# EAGLE board miniSpartan6+_Rev_B (EAGLE 7.1.0), part 1 of 2
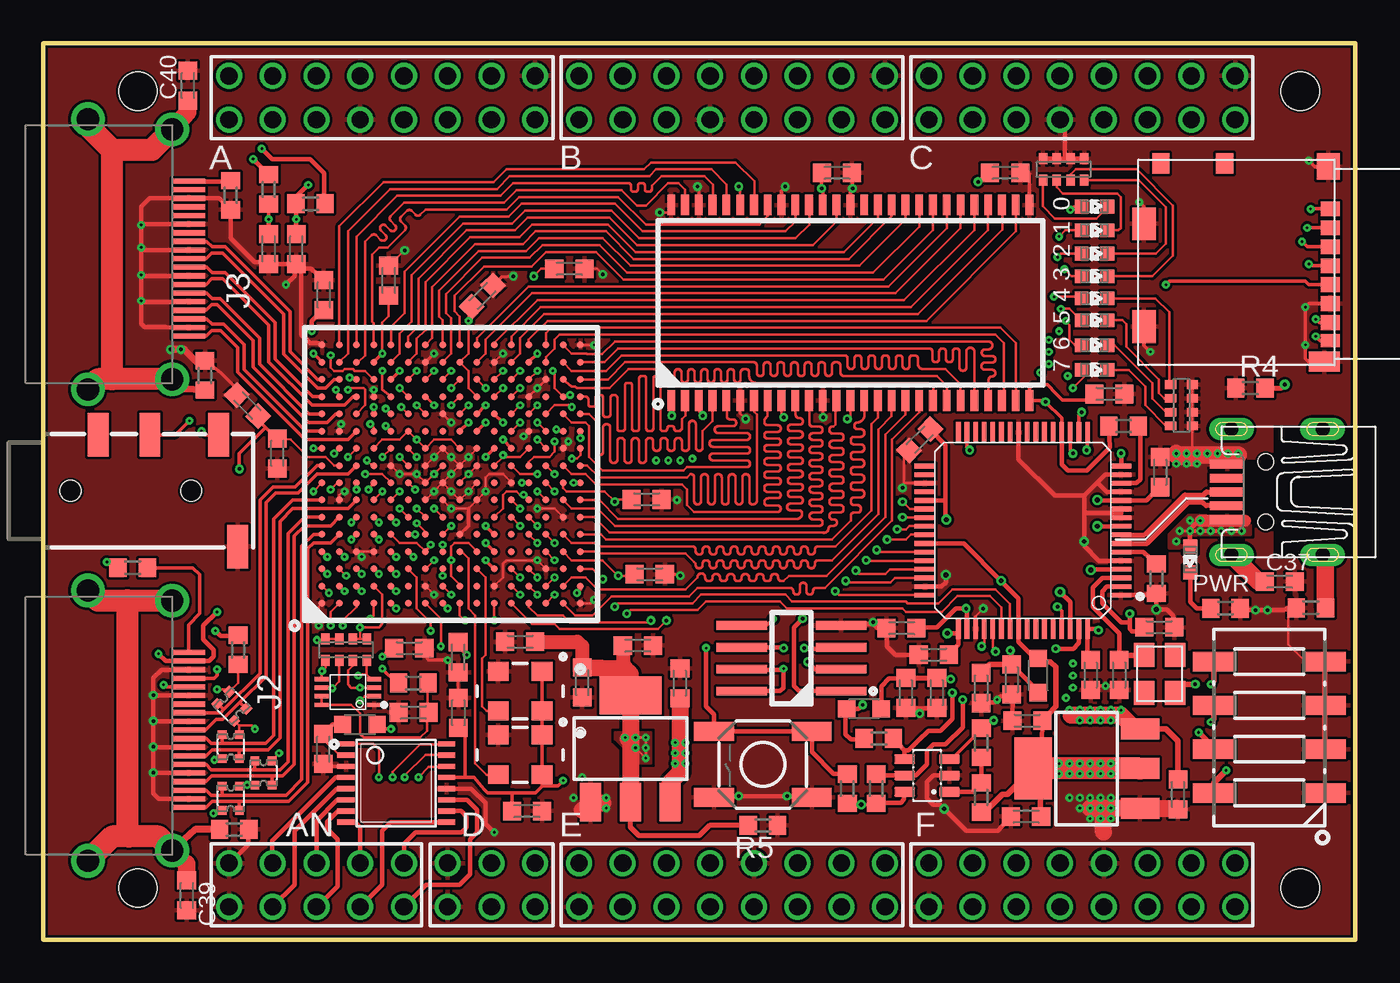
[diagram p4: board, top side]
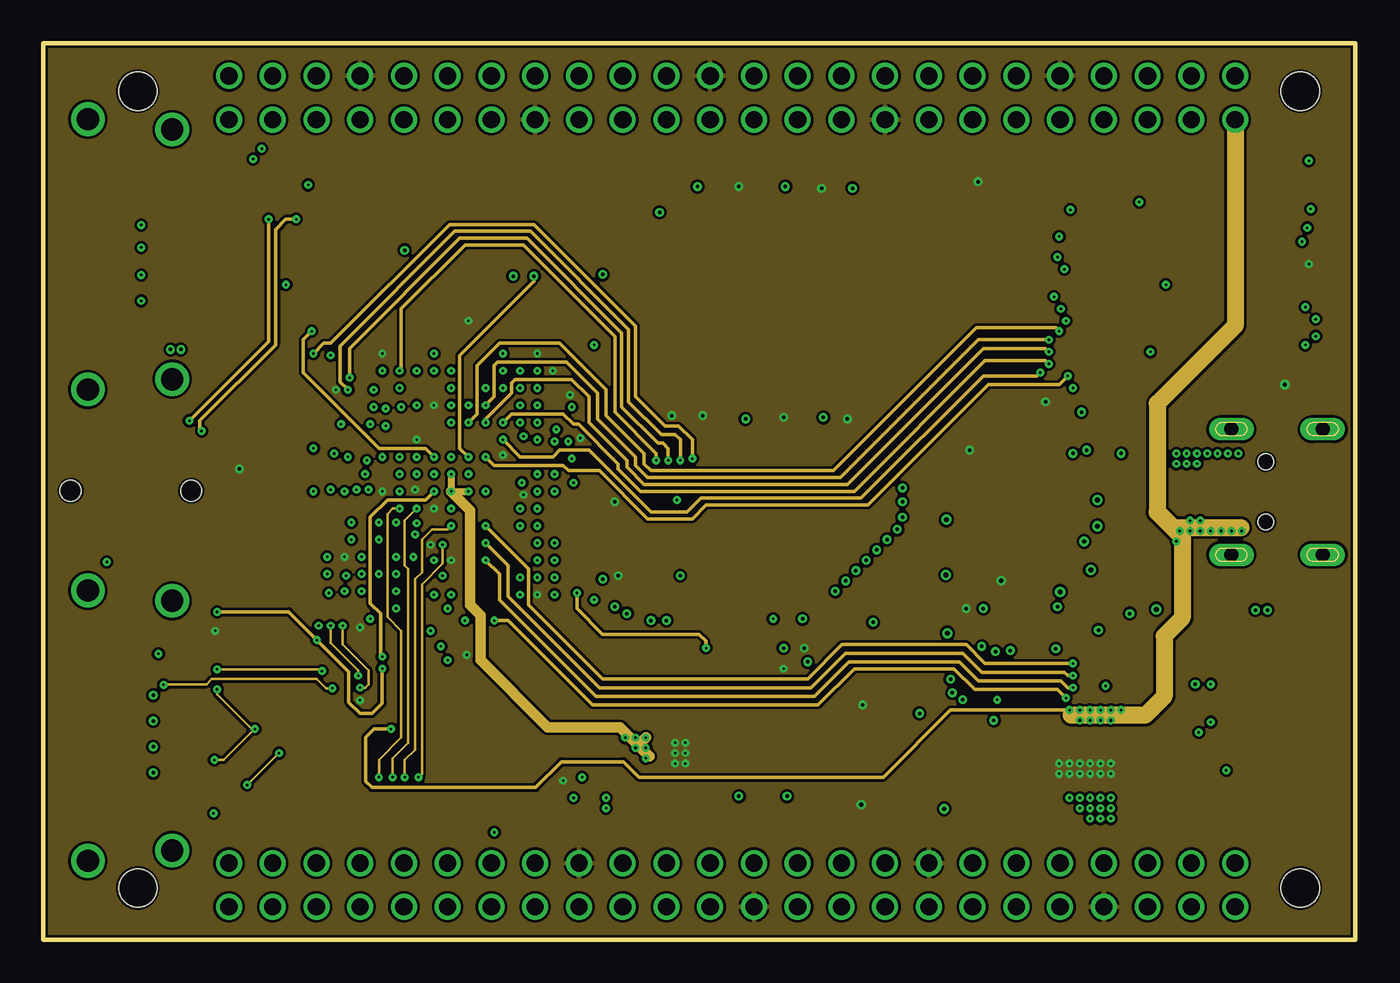
[diagram p5: board, inner layer Route3]
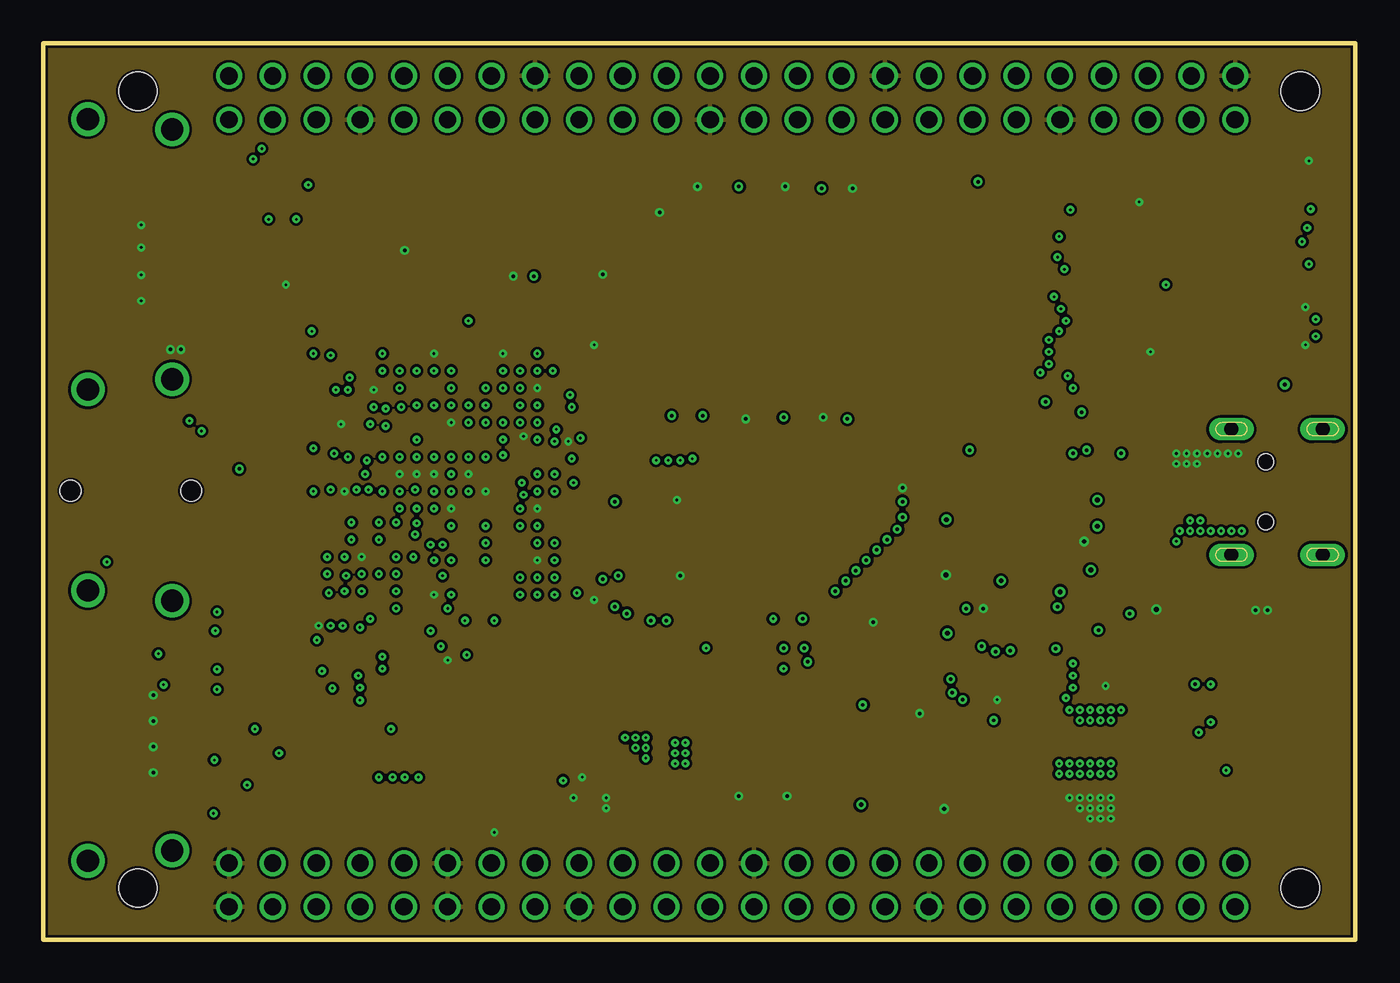
[diagram p6: board, inner layer Route4]
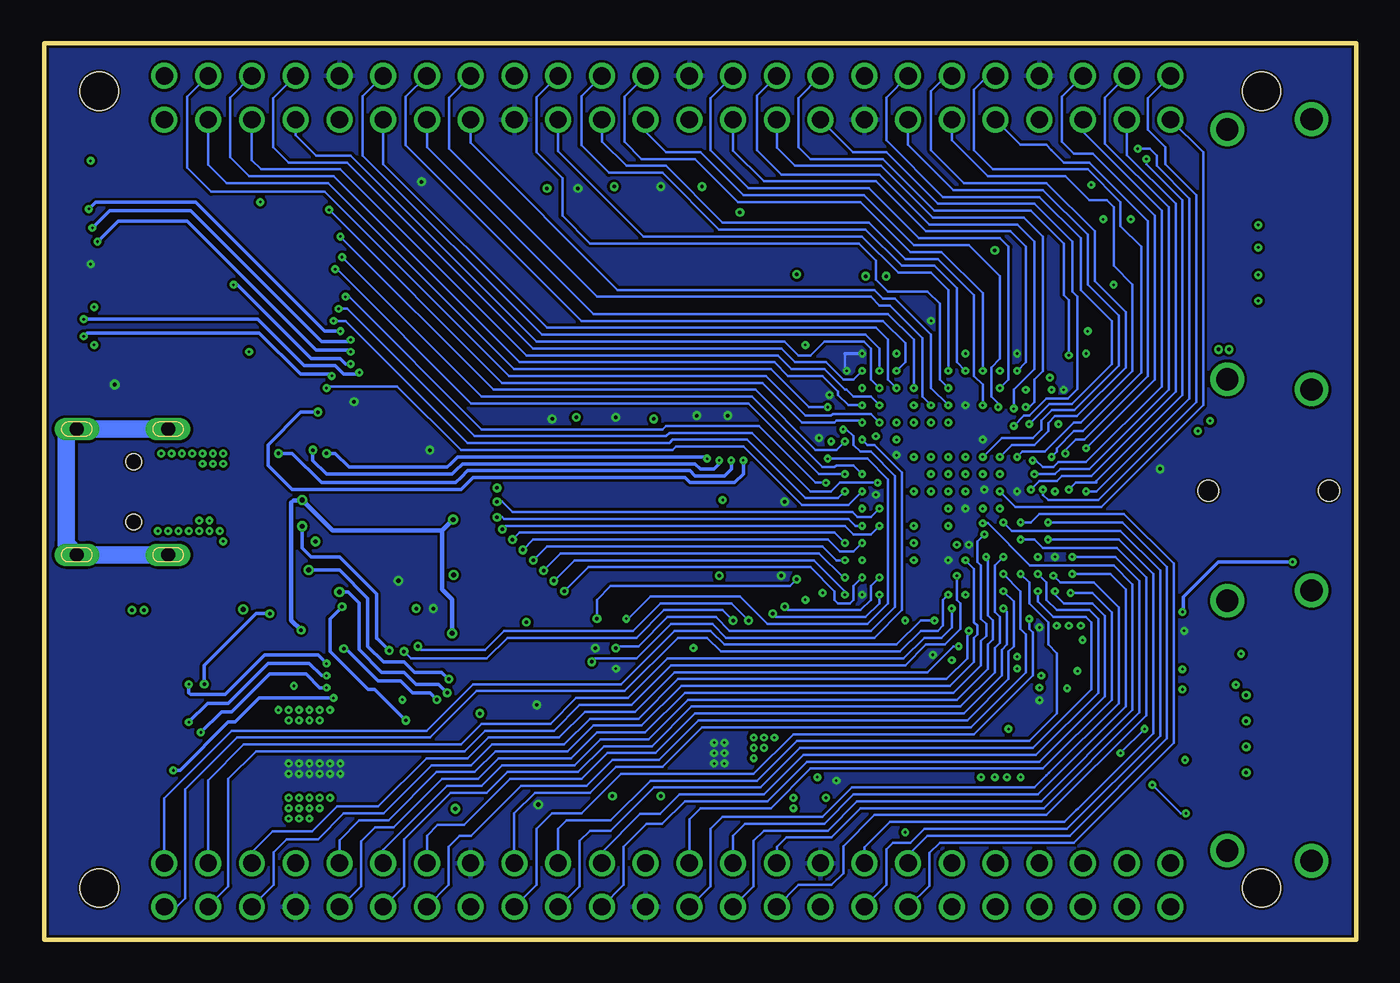
[diagram p7: board, bottom side, seen from below]

Size 76.2 x 52.07 mm. Coordinates in mm from the lower left corner, seen from the top.
Outline: 0,0 76.2,0 76.2,52.07 0,52.07 0,0
Copper layers (1*3+4*16): Top 0.035mm / dielectric 0.2mm / Route3 0.035mm / dielectric 1mm / Route4 0.035mm / dielectric 0.25mm / Bottom 0.035mm
Design rules "default *": minimum track width 6mil, minimum drill 6mil, track to track 6mil, track to pad 6mil, pad to pad 6mil, via to via 6mil, smd to smd 0mil, copper to edge 6mil, drill to drill 6mil, minimum pad ring 10mil, minimum via ring 6mil, stop-mask expansion 2mil, vias tented up to drill 100mil, thermal gap 6mil
Net classes: 1 power: width 0.203 mm
Holes 2.2 mm at 5.5,49.27 73,49.27 73,3 5.5,3
tRestrict: 1 lines

## Footprints (pad centres in the part's own frame; a part is rotated, then mirrored left to right if it is on the bottom)
C0603K = smd 1.05 x 1.08: 1 -0.875,0; 2 0.875,0
FCI-HDMI-TYPE-A-RECEPT = smd 1.9 x 0.3: 1 -0.95,4.5; 2 -0.95,4; 3 -0.95,3.5; 4 -0.95,3; 5 -0.95,2.5; 6 -0.95,2; 7 -0.95,1.5; 8 -0.95,1; 9 -0.95,0.5; 10 -0.95,0; 11 -0.95,-0.5; 12 -0.95,-1; 13 -0.95,-1.5; 14 -0.95,-2; 15 -0.95,-2.5; 16 -0.95,-3; 17 -0.95,-3.5; 18 -0.95,-4; 19 -0.95,-4.5 | drill 1.3: SH1 4.9,7.6; SH2 0,7; SH3 0,-7.5; SH4 4.9,-8.1
1X24 = drill 1: P$1 29.21,0; P$2 26.67,0; P$3 24.13,0; P$4 21.59,0; P$5 19.05,0; P$6 16.51,0; P$7 13.97,0; P$8 11.43,0; P$9 8.89,0; P$10 6.35,0; P$11 3.81,0; P$12 1.27,0; P$13 -1.27,0; P$14 -3.81,0; P$15 -6.35,0; P$16 -8.89,0; P$17 -11.43,0; P$18 -13.97,0; P$19 -16.51,0; P$20 -19.05,0; P$21 -21.59,0; P$22 -24.13,0; P$23 -26.67,0; P$24 -29.21,0
MICROSD_104031 = smd 1.55 x 1.35: G1 5.565,0.375 | smd 1.17 x 1.8: G2 -5.755,0.6 | smd 1.9 x 1.35: G3 -3.73,11.075; G4 2.24,11.075 | smd 1.2 x 1: S1 5.74,10.1; S2 5.74,6.4 | smd 0.85 x 1.1: T1 3.105,0.25; T2 2.005,0.25; T3 0.905,0.25; T4 -0.195,0.25; T5 -1.295,0.25; T6 -2.395,0.25; T7 -3.495,0.25 | smd 0.75 x 1.1: T8 -4.545,0.25
AUDIO-JACK-TRRS-SMD = smd 1.2 x 2.5: EARTH 11.3,-3.25; RING1 6.2,3.25; RING2 3.2,3.25; TIP 10.2,3.25 | hole 1.2: 1.6,0; 8.6,0
L2012C = smd 1 x 1: 1 -1,0; 2 1,0
SML0603 = smd 0.8 x 0.8: A 0.75,0; C -0.75,0
CRYSTAL3.2X2.5MM = smd 1.4 x 1.2: 1 -1.1,-0.9; 2 1.1,-0.9; 3 1.1,0.9; 4 -1.1,0.9
R0603 = smd 1 x 1.1: 1 -0.85,0; 2 0.85,0
0603-ARV = smd 0.5 x 0.65: 1 -1.2,-0.625; 2 -0.4,-0.625; 3 0.4,-0.625; 4 1.2,-0.625; 5 1.2,0.625; 6 0.4,0.625; 7 -0.4,0.625; 8 -1.2,0.625
EXB34V = smd 0.5 x 0.5: 1 -0.5,-0.7; 2 0.5,-0.7; 3 0.5,0.7; 4 -0.5,0.7
TACTILE_SWITCH_SMD = smd 2.3 x 1.1: 1 -2.84,1.905; 2 2.84,1.905; 3 -2.84,-1.905; 4 2.84,-1.905
CTS-219-04J = smd 1.13 x 2.44: 1 -3.81,-3.215; 2 -1.27,-3.215; 3 1.27,-3.215; 4 3.81,-3.215; 5 3.81,3.215; 6 1.27,3.215; 7 -1.27,3.215; 8 -3.81,3.215
SOT23-6 = smd 0.55 x 1.2: 1 -0.95,-1.3; 2 0,-1.3; 3 0.95,-1.3; 4 0.95,1.3; 5 0,1.3; 6 -0.95,1.3
LQFP64 = smd 1.2 x 0.27: 1 -5.7,3.75; 2 -5.7,3.25; 3 -5.7,2.75; 4 -5.7,2.25; 5 -5.7,1.75; 6 -5.7,1.25; 7 -5.7,0.75; 8 -5.7,0.25; 9 -5.7,-0.25; 10 -5.7,-0.75; 11 -5.7,-1.25; 12 -5.7,-1.75; 13 -5.7,-2.25; 14 -5.7,-2.75; 15 -5.7,-3.25; 16 -5.7,-3.75; 33 5.7,-3.75; 34 5.7,-3.25; 35 5.7,-2.75; 36 5.7,-2.25; 37 5.7,-1.75; 38 5.7,-1.25; 39 5.7,-0.75; 40 5.7,-0.25; 41 5.7,0.25; 42 5.7,0.75; 43 5.7,1.25; 44 5.7,1.75; 45 5.7,2.25; 46 5.7,2.75; 47 5.7,3.25; 48 5.7,3.75 | smd 0.27 x 1.2: 17 -3.75,-5.7; 18 -3.25,-5.7; 19 -2.75,-5.7; 20 -2.25,-5.7; 21 -1.75,-5.7; 22 -1.25,-5.7; 23 -0.75,-5.7; 24 -0.25,-5.7; 25 0.25,-5.7; 26 0.75,-5.7; 27 1.25,-5.7; 28 1.75,-5.7; 29 2.25,-5.7; 30 2.75,-5.7; 31 3.25,-5.7; 32 3.75,-5.7; 49 3.75,5.7; 50 3.25,5.7; 51 2.75,5.7; 52 2.25,5.7; 53 1.75,5.7; 54 1.25,5.7; 55 0.75,5.7; 56 0.25,5.7; 57 -0.25,5.7; 58 -0.75,5.7; 59 -1.25,5.7; 60 -1.75,5.7; 61 -2.25,5.7; 62 -2.75,5.7; 63 -3.25,5.7; 64 -3.75,5.7
TSSOP16 = smd 0.305 x 0.991: 1 -2.275,-2.918; 2 -1.625,-2.918; 3 -0.975,-2.918; 4 -0.325,-2.918; 5 0.325,-2.918; 6 0.975,-2.918; 7 1.625,-2.918; 8 2.275,-2.918; 9 2.275,2.918; 10 1.625,2.918; 11 0.975,2.918; 12 0.325,2.918; 13 -0.325,2.918; 14 -0.975,2.918; 15 -1.625,2.918; 16 -2.275,2.918
SOT223 = smd 1.219 x 2.235: 1 -2.311,-3.099; 2 0,-3.099; 3 2.311,-3.099 | smd 3.6 x 2.2: 4 0,3.099
XILINX-FT256 = smd 0.4 x 0.4: A1 0,0; A2 1,0; A3 2,0; A4 3,0; A5 4,0; A6 5,0; A7 6,0; A8 7,0; A9 8,0; A10 9,0; A11 10,0; A12 11,0; A13 12,0; A14 13,0; A15 14,0; A16 15,0; B1 0,-1; B2 1,-1; B3 2,-1; B4 3,-1; B5 4,-1; B6 5,-1; B7 6,-1; B8 7,-1; B9 8,-1; B10 9,-1; B11 10,-1; B12 11,-1; B13 12,-1; B14 13,-1; B15 14,-1; B16 15,-1; C1 0,-2; C2 1,-2; C3 2,-2; C4 3,-2; C5 4,-2; C6 5,-2; C7 6,-2; C8 7,-2; C9 8,-2; C10 9,-2; C11 10,-2; C12 11,-2; C13 12,-2; C14 13,-2; C15 14,-2; C16 15,-2; D1 0,-3; D2 1,-3; D3 2,-3; D4 3,-3; D5 4,-3; D6 5,-3; D7 6,-3; D8 7,-3; D9 8,-3; D10 9,-3; D11 10,-3; D12 11,-3; D13 12,-3; D14 13,-3; D15 14,-3; D16 15,-3; E1 0,-4; E2 1,-4; E3 2,-4; E4 3,-4; E5 4,-4; E6 5,-4; E7 6,-4; E8 7,-4; E9 8,-4; E10 9,-4; E11 10,-4; E12 11,-4; E13 12,-4; E14 13,-4; E15 14,-4; E16 15,-4; F1 0,-5; F2 1,-5; F3 2,-5; F4 3,-5; F5 4,-5; F6 5,-5; F7 6,-5; F8 7,-5; F9 8,-5; F10 9,-5; F11 10,-5; F12 11,-5; F13 12,-5; F14 13,-5; F15 14,-5; F16 15,-5; G1 0,-6; G2 1,-6; G3 2,-6; G4 3,-6; G5 4,-6; G6 5,-6; G7 6,-6; G8 7,-6; G9 8,-6; G10 9,-6; G11 10,-6; G12 11,-6; G13 12,-6; G14 13,-6; G15 14,-6; G16 15,-6; H1 0,-7; H2 1,-7; H3 2,-7; H4 3,-7; H5 4,-7; H6 5,-7; H7 6,-7; H8 7,-7; H9 8,-7; H10 9,-7; H11 10,-7; H12 11,-7; H13 12,-7; H14 13,-7; H15 14,-7; H16 15,-7; J1 0,-8; J2 1,-8; J3 2,-8; J4 3,-8; J5 4,-8; J6 5,-8; J7 6,-8; J8 7,-8; J9 8,-8; J10 9,-8; J11 10,-8; J12 11,-8; J13 12,-8; J14 13,-8; J15 14,-8; J16 15,-8; K1 0,-9; K2 1,-9; K3 2,-9; K4 3,-9; K5 4,-9; K6 5,-9; K7 6,-9; K8 7,-9; K9 8,-9; K10 9,-9; K11 10,-9; K12 11,-9; K13 12,-9; K14 13,-9; K15 14,-9; K16 15,-9; L1 0,-10; L2 1,-10; L3 2,-10; L4 3,-10; L5 4,-10; L6 5,-10; L7 6,-10; L8 7,-10; L9 8,-10; L10 9,-10; L11 10,-10; L12 11,-10; L13 12,-10; L14 13,-10; L15 14,-10; L16 15,-10; M1 0,-11; M2 1,-11; M3 2,-11; M4 3,-11; M5 4,-11; M6 5,-11; M7 6,-11; M8 7,-11; M9 8,-11; M10 9,-11; M11 10,-11; M12 11,-11; M13 12,-11; M14 13,-11; M15 14,-11; M16 15,-11; N1 0,-12; N2 1,-12; N3 2,-12; N4 3,-12; N5 4,-12; N6 5,-12; N7 6,-12; N8 7,-12; N9 8,-12; N10 9,-12; N11 10,-12; N12 11,-12; N13 12,-12; N14 13,-12; N15 14,-12; N16 15,-12; P1 0,-13; P2 1,-13; P3 2,-13; P4 3,-13; P5 4,-13; P6 5,-13; P7 6,-13; P8 7,-13; P9 8,-13; P10 9,-13; P11 10,-13; P12 11,-13; P13 12,-13; P14 13,-13; P15 14,-13; P16 15,-13; R1 0,-14; R2 1,-14; R3 2,-14; R4 3,-14; R5 4,-14; R6 5,-14; R7 6,-14; R8 7,-14; R9 8,-14; R10 9,-14; R11 10,-14; R12 11,-14; R13 12,-14; R14 13,-14; R15 14,-14; R16 15,-14; T1 0,-15; T2 1,-15; T3 2,-15; T4 3,-15; T5 4,-15; T6 5,-15; T7 6,-15; T8 7,-15; T9 8,-15; T10 9,-15; T11 10,-15; T12 11,-15; T13 12,-15; T14 13,-15; T15 14,-15; T16 15,-15
CRYSTAL-OSC-SMD-5X3 = smd 1.2 x 1.1: 1 -1.27,-1.15; 2 1.27,-1.15; 3 1.27,1.15; 4 -1.27,1.15
TSOPII-54 = smd 1.2 x 0.45: 1 0,0; 2 0,-0.8; 3 0,-1.6; 4 0,-2.4; 5 0,-3.2; 6 0,-4; 7 0,-4.8; 8 0,-5.6; 9 0,-6.4; 10 0,-7.2; 11 0,-8; 12 0,-8.8; 13 0,-9.6; 14 0,-10.4; 15 0,-11.2; 16 0,-12; 17 0,-12.8; 18 0,-13.6; 19 0,-14.4; 20 0,-15.2; 21 0,-16; 22 0,-16.8; 23 0,-17.6; 24 0,-18.4; 25 0,-19.2; 26 0,-20; 27 0,-20.8; 28 11.36,-20.8; 29 11.36,-20; 30 11.36,-19.2; 31 11.36,-18.4; 32 11.36,-17.6; 33 11.36,-16.8; 34 11.36,-16; 35 11.36,-15.2; 36 11.36,-14.4; 37 11.36,-13.6; 38 11.36,-12.8; 39 11.36,-12; 40 11.36,-11.2; 41 11.36,-10.4; 42 11.36,-9.6; 43 11.36,-8.8; 44 11.36,-8; 45 11.36,-7.2; 46 11.36,-6.4; 47 11.36,-5.6; 48 11.36,-4.8; 49 11.36,-4; 50 11.36,-3.2; 51 11.36,-2.4; 52 11.36,-1.6; 53 11.36,-0.8; 54 11.36,0
SPI-8_SOIC_150_208 = smd 2.921 x 0.51: 1 1.06,0; 2 1.06,-1.27; 3 1.06,-2.54; 4 1.06,-3.81; 5 6.839,-3.81; 6 6.839,-2.54; 7 6.839,-1.27; 8 6.839,0
PSOP-8 = smd 0.25 x 0.8: 1 -0.73,-1.52; 2 -0.23,-1.52; 3 0.27,-1.52; 4 0.77,-1.52; 5 0.77,1.53; 6 0.27,1.53; 7 -0.23,1.53; 8 -0.73,1.53
UX60-MB-5S8 = smd 2 x 0.5: 1 8.65,1.6; 2 8.65,0.8; 3 8.65,0; 4 8.65,-0.8; 5 8.65,-1.6 | drill 0.8 long: M1 3.1,-3.65; M2 3.1,3.65; M3 8.4,3.65; M4 8.4,-3.65 | hole 0.9: 6.4,-1.75; 6.4,1.75

## Placement (x,y rotation side)
C1  4.7uF  [C0603K]  50.1,14.33 270 top
C2  4.7uF  [C0603K]  50.9,29.04 225 top
C3  .1uF  [C0603K]  51.9,14.33 270 top
C4  .1uF  [C0603K]  51.72,16.54 180 top
C5  27pF  [C0603K]  64.81,18.15 0 top
C6  4.7uF  [C0603K]  54.47,14.61 270 top
C7  .1uF  [C0603K]  64.87,27.15 90 top
C8  .1uF  [C0603K]  56.25,15.11 270 top
C9  .1uF  [C0603K]  60.83,15.38 270 top
C10  27pF  [C0603K]  62.48,15.38 270 top
C11  4.7uF  [C0603K]  16.28,11.07 270 top
C12  4.7uF  [C0603K]  49.85,18.09 180 top
C13  4.7uF  [C0603K]  24.11,13.17 90 top
C14  4700pF  [C0603K]  14.7,40.1 270 top
C15  4700pf  [C0603K]  13.1,40.1 270 top
C16  .1uF  [C0603K]  35.23,21.22 0 top
C17  .1uF  [C0603K]  35.04,25.56 0 top
C18  4.7uF  [C0603K]  65.9,8.44 270 top
C19  .1uF  [C0603K]  13.6,28.24 270 top
C20  .1uF  [C0603K]  24.1,16.4 270 top
C21  .1uF  [C0603K]  30.56,38.96 0 top
C22  .1uF  [C0603K]  27.7,17.3 180 top
C23  .1uF  [C0603K]  16.3,37.43 90 top
C24  4.7uF  [C0603K]  57.08,7.16 180 top
C25  .1uF  [C0603K]  34.53,17.08 0 top
C26  .1uF  [C0603K]  25.51,37.38 45 top
C27  .1uF  [C0603K]  20.07,38.28 90 top
C28  22uF  [C0603K]  31.3,14.94 270 top
C29  .1uF  [C0603K]  28.1,7.47 0 top
C30  .1uF  [C0603K]  11.87,31.01 135 top
C31  4.7uF  [C0603K]  21.27,16.92 0 top
C32  .1uF  [C0603K]  55.87,44.53 0 top
C33  1uF  [C0603K]  21.51,13.2 180 top
C34  .1uF  [C0603K]  36.98,14.88 90 top
C35  .1uF  [C0603K]  61.91,31.69 0 top
C36  .1uF  [C0603K]  46.1,44.53 0 top
C37  .1uF  [C0603K]  71.81,20.8 0 top
C38  22uF  [C0603K]  57.15,12.72 180 top
C39  .1uF  [C0603K]  8.34,2.58 270 top
C40  .1uF  [C0603K]  8.4,49.59 90 top
J2  HDMI-TYPE-A-RECEPTICALFCI10029449  [FCI-HDMI-TYPE-A-RECEPT]  7.5,12.18 180 top
J3  HDMI-TYPE-A-RECEPTICALFCI10029449  [FCI-HDMI-TYPE-A-RECEPT]  7.5,39.55 180 top
J4  P24-1  [1X24]  40.01,1.91 180 top
J5  MICROSD_MOLEX  [MICROSD_104031]  75,39.34 90 top
J6  P24-1  [1X24]  40.01,4.45 180 top
JP5  AUDIO-JACK3  [AUDIO-JACK-TRRS-SMD]  0,26.07 0 top
L1  [L2012C]  47.67,13.39 180 top
L2  [L2012C]  57.77,15.34 90 top
L3  FERRITEBEAD  [L2012C]  18.4,12.5 0 top
LED1  Green  [SML0603]  61.05,42.57 180 top
LED2  Green  [SML0603]  61.05,41.2 180 top
LED3  Green  [SML0603]  61.05,38.52 180 top
LED4  Green  [SML0603]  61.05,39.84 180 top
LED5  Green  [SML0603]  61.05,35.97 180 top
LED6  Green  [SML0603]  61.05,33.09 180 top
LED7  Green  [SML0603]  61.05,34.52 180 top
LED8  Green  [SML0603]  61.05,37.24 180 top
LED9  Green  [SML0603]  66.61,22.08 90 top
Q1  12MHz  [CRYSTAL3.2X2.5MM]  64.83,15.44 90 top
R1  100K  [R0603]  73.61,19.28 0 top
R2  100K  [R0603]  11.1,6.4 180 top
R3  100K  [R0603]  9.4,32.77 270 top
R4  470  [R0603]  70.1,32.03 0 top
R5  470  [R0603]  41.8,6.63 180 top
R6  100K  [R0603]  21.5,14.9 0 top
R7  0  [R0603]  11.34,16.84 270 top
R8  10K  [R0603]  54.47,8.26 270 top
R10  10K  [R0603]  48.38,8.77 270 top
R11  2.2K  [R0603]  54.47,11.44 90 top
R13  10K  [R0603]  48.53,11.69 180 top
R14  10K  [R0603]  5.21,21.6 0 top
R15  12K  [R0603]  64.64,20.96 90 top
R16  10K  [R0603]  62.74,29.83 0 top
R17  10K  [R0603]  10.9,43.23 90 top
R18  47K  [R0603]  46.7,8.77 270 top
R19  3.3K  [R0603]  13.1,43.57 270 top
R20  3.3K  [R0603]  15.54,42.73 180 top
R21  1K8  [R0603]  68.66,19.25 180 top
RN1  1k  [0603-ARV]  59.26,44.73 180 top
RN2  1k  [0603-ARV]  66.1,31.04 90 top
RN3  51  [EXB34V]  12.8,9.69 0 top
RN4  51  [EXB34V]  10.9,8.21 0 top
RN5  2k  [0603-ARV]  17.6,16.84 180 top
RN8  51  [EXB34V]  10.9,11.21 0 top
RN9  51  [EXB34V]  10.96,13.56 45 top
S1  SWITCH-MOMENTARY-2SMD  [TACTILE_SWITCH_SMD]  41.8,10.18 180 top
S2  219-04J  [CTS-219-04J]  71.2,12.33 90 top
U1  93C46B  [SOT23-6]  51.32,9.53 90 top
U2  FT2232HL  [LQFP64]  56.9,23.76 180 top
U3  ADC088S102CIMT  [TSSOP16]  20.5,9.1 270 top
U4  +3.3V Reg.  [SOT223]  60.59,9.94 90 top
U5  +1.2V Reg.  [SOT223]  34.1,11.09 0 top
U6  XC6SLX25-FT256  [XILINX-FT256]  16.2,19.54 90 top
U7  ASFLMB-32.000MHZ-LC-T  [CRYSTAL-OSC-SMD-5X3]  27.7,10.73 180 top
U8  ASFLMB-50.000MHZ-LC-T  [CRYSTAL-OSC-SMD-5X3]  27.7,14.44 180 top
U9  SDRAM-16MX16-WINBOND  [TSOPII-54]  36.48,31.31 90 top
U10  SPI_FLASH-SOIC_150_208  [SPI-8_SOIC_150_208]  47.4,14.44 180 top
U11  PCA9306  [PSOP-8]  17.7,14.37 90 top
U$7  P24-1  [1X24]  40.01,47.62 180 top
U$8  P24-1  [1X24]  40.01,50.16 180 top
X1  MINI-USB-UX60-MB-5S8  [UX60-MB-5S8]  77.4,26 180 top

## Tracks (layer width: path | path; a pad name or v marks a point on that pad's centre or on a via)
1V2  (via drill 0.15, 0.2)
  Top 0.152: U6.K10 v24.7,28.04 U6.J9 | U6.J9 v23.7,28.04 U6.H10 v22.7,28.04 U6.G9 | U6.J9 v23.7,27.04 U6.H8 | U6.H8 v22.7,26.04 U6.G7 | U6.H8 v23.7,26.04 U6.J7 v24.7,26.04 U6.K8 | C21.1 28.93,38.96 v28.5,38.53 | v34.4,11.13 v35,10.54 v35,11.13 v35,11.73 v34.4,11.73 v33.8,11.73 33.88,11.66 33.98,11.66 | C23.1 16.28,36.61
  Top 0.203: 31.3,15.76 C28.1 | C31.1 20.21,17.02 20.21,16.95 v19.7,16.44
  Top 0.254: 16.28,36.61 15.6,35.93 v15.6,35.34
  Top 0.28: R5.2 38.7,6.63 38.1,6.04 34.6,6.04 34.1,6.54 U5.2
  Top 0.61: U5.2
  Top 0.813: C22.1 31.04,17.3 31.3,17.04 C28.1 | C25.1 33.71,15.82 33.78,15.76
  Top 1: C28.1 33.78,15.76 34.1,15.43 U5.4 34.1,11.54 | 34.1,11.54 U5.2 | 33.98,11.66 34.1,11.54
  Route3 0.2: v15.6,35.34 15.1,34.84 15.1,32.93 19.5,28.54 22.2,28.54 v22.7,28.04 | 19,19.54 19,24.54 20,25.54 U6.G7 v22.7,26.04 | v28.5,38.53 28.5,38.23 24.2,33.93 24.2,28.54 v24.7,28.04
  Route3 0.203: 19,19.54 19.6,18.94 19.6,16.54 v19.7,16.44
  Route3 0.254: v35,10.54 35,10.83 34.7,11.13
  Route3 0.406: v24.7,26.04 v23.7,26.04 v23.7,27.04
  Route3 0.6: v23.7,26.04 24.8,24.94 24.8,19.44 25.4,18.84 | 29.3,12.33 33.5,12.33 34.7,11.13 35.2,10.63 | v35,11.73 34.6,11.33
  Route3 0.61: 25.4,18.84 25.4,16.23 29.3,12.33
  pour Top: 33.2,12.04 35.3,12.04 35.3,10.23 34.6,10.23 33.2,11.63
  pour Top: 22,28.64 25,28.64 25,25.64 22,25.64
3V3  (via drill 0.15, 0.15 pad 0.03, 0.2, 0.25)
  Top 0.152: v33.2,25.44 32.6,26.04 30.4,26.04 30.2,26.24 U6.R8 | v19.7,34.03 19.7,35.84 20.07,36.2 C27.1 | U6.B13 v17,31.94 | U6.T11 v31.2,29.14 | U6.N2 v28.7,20.04 | U6.R4 30.7,22.04 32.5,22.04 v33.4,21.14 34.32,21.14 C16.1 | U9.14 46.88,30.41 v46.7,30.24 | U9.9 42.88,30.46 v43,30.34 | U9.3 38.08,30.66 v38.3,30.44 | U9.1 36.48,30.46 v36.5,30.44 | U9.49 40.48,43.66 v40.4,43.73 | 53.65,19.19 v53.6,19.24 | 50.72,18.14 C12.1 | 39.7,15.67 40.52,15.67 U10.7 | 33.37,25.57 v33.2,25.44 | U6.J10 23.7,29.04 22.7,29.04 U6.G10 v21.7,29.04 U6.F11 20.7,29.04 19.7,29.04 U6.D10 | U6.N10 27.7,28.04 26.7,28.04 | 26.7,28.04 U6.L9 | U6.N7 v27.9,25.84 27.7,25.84 27.5,26.04 26.9,26.04 26.7,25.84 26.7,25.04 U6.L6 | U6.B4 v17.5,22.24 | U6.F8 v21.6,26.14 | U6.D7 v19.7,26.04 | U6.H6 v22.7,25.04 | U6.E5 20.7,23.04 21.7,23.04 U6.G4 v22.5,22.94 | R13.2 47.66,11.69 47.6,11.63 | 46.6,13.32 L1.2 | 42.97,15.67 v43,15.73 | 26.7,28.04 v26.7,28.14 | R8.2 54.73,7.46 | U4.4 57.14,9.59 57.9,8.83 | U6.K13 24.7,32.03 24.7,33.03 U6.J15 24.7,34.03 v24.7,35.93 24.7,36.64 24.86,36.8 C26.1 | v29.6,33.03 29.7,32.93 29.7,32.03 U6.R13 30.5,31.54 v30.6,31.64 | 37,13.88 37,14.04 C34.1 | C17.1 33.33,25.57 v33.2,25.44 | C19.1 14.38,29.06 15.4,28.04 16.4,28.04 16.9,27.54 U6.B9 | U11.2 18.66,14.13 v18.4,13.9 | R7.1 11.3,17.69 11.3,17.64 | 24.1,16.9 24.1,17.04 C20.1 | U6.J2 24.2,20.64 23.7,21.14 v23.7,22.04 23.7,22.84 23.9,23.04 24.7,23.04 U6.K4 | U6.D2 19.7,20.04 19.7,18.34 19.5,18.14 v18.4,18.14 18.4,17.46 RN5.2 RN5.1
  Top 0.178: U6.G13 v22.7,31.04
  Top 0.2: J5.T4 73.69,39.14 73.6,39.23 v73.5,39.23 | 58.85,31.69 59.2,31.34 60.73,31.34 C35.1 | 37,9.73 37,9.94 v37.3,10.23 | U6.N15 v28.7,34.03 | C32.1 54.8,44.53 v54.28,44.02
  Top 0.203: U6.D15 v19.7,34.03 | U2.20 59.15,30.29 v58.2,31.24 58.12,31.31 U9.27 | U2.31 53.65,28.59 v53.8,28.44 | 24.7,36.64 24.7,36.65 | 40.7,14.44 U10.8 39.8,14.44 39.7,14.54 | U9.43 45.27,43.56 v45.2,43.63 45.2,44.54 C36.1 | 57.3,31.74 57.3,31.34 U9.27 | U9.27 57.27,32.01 57.49,32.22 58.31,32.22 58.85,31.69 | R18.2 46.8,7.83 v47.5,7.83 48.24,7.83 R10.2 | C30.1 12.46,30.2 12.91,29.75 | 12.91,29.75 C19.1 | v11.4,27.34 11.4,28.24 12.91,29.75 | U8.4 U8.1 28.98,13.23 U7.4 | U7.4 U7.1 | U3.13 24.5,9.42 | 24.5,9.42 25.01,9.42 25.6,8.73 25.8,8.54 27.3,8.54 | 27.3,8.54 28.6,8.54 28.97,8.9 | U7.4 28.97,8.9 | C13.1 24.19,12.35 24.5,12.04 24.5,9.42 | 28.97,8.9 29,8.94 29.9,8.94 v30.2,9.23 | 24.1,17.04 v24.6,16.54 | 27.3,8.54 27.23,8.46 C29.1
  Top 0.254: 57.77,16.14 L2.2 57.59,16.34 56.65,17.29 U2.56 56.65,19.82 v55.63,20.84 53.45,23.01 U2.42 | R16.1 61.94,28.58 60.6,27.24 59.5,27.24 59.15,27.59 U2.20 | U2.50 53.65,19.19 | v53.6,19.24 53,19.24 51.9,18.14 50.72,18.14 | R10.2 48.31,7.93 49.8,7.93 50,8.13 50,8.56 U1.6 | U10.3 45.04,16.9 44.26,16.9 v44.2,16.94 | C38.1 57.98,10.12 U4.4 | 47.6,11.63 46.9,11.63 46.6,11.94 46.6,13.32 | 40.52,15.67 42.97,15.67 | v43,15.73 43,14.63 42.8,14.44 U10.8 | L1.2 47.36,13.39 v47.6,13.63 | 11.3,17.64 10.3,17.63 v10,17.94
  Top 0.28: R4.2 71.9,32.03 v72.1,32.23
  Top 0.305: 57.77,16.14 58.5,16.14 58.8,15.83 58.8,13.54 C38.1 | 54.73,7.46 55.7,8.44 55.99,8.44 57.14,9.59 | C24.1 57.9,7.16 57.9,8.83
  Top 1: U5.3 36.41,9.15 37,9.73 37,13.88
  Top 1.27: U4.2 U4.4
  Bottom 0.152: 29.7,34.03 29.7,33.13 v29.6,33.03 | J4.P$13 41.27,1.93
  Bottom 0.2: v28.7,34.03 29.7,34.03
  other vias: 36.7,10.23 36.7,10.83 37.3,10.83 37.3,11.44 59,10.23 59.6,10.23 59.6,9.63 59,9.63 60.2,10.23 60.2,9.63 60.8,10.23 60.8,9.63 61.4,10.23 61.4,9.63 62,10.23 62,9.63 36.7,11.44
  pour Top: 36.6,9.94 37.4,11.13 37.4,12.33 36.6,12.33
  pour Route3: 0,0 76.2,0 76.2,52.07 0,52.07
  pour Bottom: 0,0 76.2,0 76.2,52.07 0,52.07
  pour Route3: 0,0 76.2,0 76.2,52.07 0,52.07
5V0  (via drill 0.15)
  Top 0.152: v66,23.74 v66.6,23.74
  Top 0.203: v60.8,13.33 v60.2,13.33 v59.6,13.33 | v62,13.33 v61.4,13.33 v61.4,12.73 v60.8,12.73 | v62,13.33 v62,12.73 | v62,13.33 v62.6,13.33 62.6,13.04 | v60.2,12.73 59.7,13.04 | 59.7,13.04 v59.6,13.33 | 59.7,13.04 59.7,13.23 v59.6,13.33 | v66.6,23.74 v67.2,23.74 v67.8,23.74 v68.4,23.74 v69,23.74 v69.6,23.74 | v20.2,12.23 19.76,12.23 L3.2
  Top 0.254: 67.2,24.44 66.6,23.84 v66.6,23.74 66.6,22.84 LED9.A | 63.8,12.23 U4.3
  Top 0.305: C18.1 65.9,11.54 65.2,12.23 63.8,12.23
  Top 0.7: v67.2,24.34 69.8,24.34
  Top 1: 59.7,13.04 62.6,13.04 63.39,12.25 U4.3
  Route3 0.152: v69.6,23.74 69.6,23.69 | 66.15,23.39 66.15,23.59 v66,23.74
  Route3 0.2: 59.7,13.04 59.7,13.23 v59.6,13.33 59.6,12.73 | 69.6,23.69 69.55,23.94
  Route3 0.203: v59.6,13.33 52.7,13.33 48.8,9.44 34.6,9.44 33.7,10.33 30.1,10.33 28.6,8.83 19.1,8.83 18.73,9.2 18.73,11.75 19.22,12.23 v20.2,12.23
  Route3 1: U$7.P$24 69.22,35.65 64.7,31.14 64.7,24.84 | 66.15,23.39 66.15,18.69 65.1,17.64 65.1,14.13 64,13.04 59.7,13.04 | 65.6,23.94 69.55,23.94
  Route3 1.016: 64.7,24.84 66.15,23.39
  other vias: 66.6,24.34 65.8,23.14
  pour Top: 65.4,23.54 66.5,24.64 70.1,24.64 70.1,23.54 66.9,23.54 66.9,22.74 65.4,22.74
A0
  Top 0.152: U9.23 54.08,34.16 arc176 53.61,34.14 53.61,33.23 arc-90 53.42,33.03 53.41,33.03 arc-90 53.22,33.23 53.22,34.14 arc90 53.02,34.34 53.01,34.34 arc90 52.82,34.14 52.82,33.73 arc-90 52.63,33.53 52.62,33.53 arc-90 52.43,33.73 52.43,34.14 arc90 52.24,34.34 52.22,34.34 arc90 52.03,34.14 52.03,33.73 arc-90 51.84,33.53 51.83,33.53 arc-90 51.64,33.73 51.64,34.14 arc90 51.45,34.34 33.4,34.34 32.6,33.53 U6.T15
A1
  Top 0.152: U6.R16 30.7,34.03 31.56,34.03 31.6,33.99 32.46,33.99 33.2,34.73 54.9,34.73 arc-182 54.89,34.28 | 54.91,34.28 54.89,34.28 | U9.24 54.9,31.34 54.9,32.5 arc-90 55.11,32.71 arc90 55.3,32.9 55.3,32.91 arc90 55.11,33.1 54.69,33.1 arc-180 54.69,33.51 55.11,33.51 arc90 55.3,33.7 55.3,33.71 arc90 55.11,33.9 54.69,33.9 arc-180 54.69,34.28 54.89,34.28
A2
  Top 0.152: U6.P15 29.2,33.84 29.7,34.34 29.7,34.84 30,35.13 55.3,35.13 55.8,34.63 55.8,31.44 U9.25
A3
  Top 0.152: U6.P16 29.2,35.23 29.5,35.53 55.6,35.53 56.48,34.66 U9.26
A4
  Top 0.152: U9.29 56.5,42.64 56.5,41.13 51.3,35.93 29.3,35.93 28.2,34.84 U6.N16
A5
  Top 0.152: U6.M15 27.7,34.03 27.7,34.93 29.1,36.34 50.8,36.34 55.7,41.23 55.7,42.64 U9.30
A6
  Top 0.152: U6.M16 27.2,35.03 28.9,36.73 50.4,36.73 54.88,41.21 U9.31
A7
  Top 0.152: U9.32 54.08,41.21 50,37.13 28.7,37.13 26.2,34.63 U6.L16
A8
  Top 0.152: U6.K15 25.7,34.03 25.7,34.84 28.4,37.53 49.5,37.53 53.27,41.31 U9.33
A9
  Top 0.152: U9.34 52.48,41.31 49.1,37.93 28.2,37.93 25.2,34.93 U6.K16
A10
  Top 0.152: U6.R15 30.7,33.03 32.7,33.03 33.6,33.93 46.52,33.93 arc-90 46.72,33.74 46.72,33.32 arc90 46.91,33.13 46.92,33.13 arc90 47.12,33.32 47.12,33.74 arc-90 47.3,33.93 47.32,33.93 arc-90 47.51,33.74 47.51,33.32 arc90 47.7,33.13 47.72,33.13 arc90 47.91,33.32 47.91,33.74 arc-90 48.1,33.93 48.12,33.93 arc-90 48.31,33.74 48.31,33.32 arc90 48.5,33.13 48.52,33.13 arc90 48.71,33.32 48.71,33.74 arc-90 48.9,33.93 48.92,33.93 arc-90 49.11,33.74 49.11,33.32 arc90 49.3,33.13 49.32,33.13 arc90 49.51,33.32 49.51,33.74 arc-90 49.7,33.93 49.72,33.93 arc-90 49.91,33.74 49.91,33.32 arc90 50.1,33.13 50.12,33.13 arc90 50.31,33.32 50.31,33.74 arc-90 50.5,33.93 50.6,33.93 arc-90 50.8,33.73 50.8,33.43 arc90 51.1,33.13 52.4,33.13 53.27,32.26 U9.22 53.2,31.39
A11
  Top 0.152: U9.35 51.67,41.21 48.8,38.34 33.7,38.34 32.1,39.93 29.2,39.93 28.36,39.09 25.6,39.09 23.9,37.39 23.9,36.49 24.2,36.2 U6.J16 24.2,34.73
A12
  Top 0.152: U6.H15 23.7,34.03 23.7,36.09 23.4,36.39 23.4,37.49 25.5,39.59 28.26,39.59 29,40.34 32.3,40.34 33.9,38.73 48.2,38.73 50.88,41.41 U9.36
A_TMDS0_N
  Top 0.2: J3.9 9.51,39.05 9.82,38.73 10.58,38.73 13.47,35.85 13.47,33.71 15.64,31.54 U6.A13
A_TMDS0_P
  Top 0.2: J3.7 9.47,38.05 9.8,38.38 10.42,38.38 13.11,35.69 13.11,33.56 15.63,31.04 17.5,31.04 18,31.54 U6.C13
A_TMDS1_N
  Top 0.2: J3.6 9.51,37.55 9.82,37.23 10.28,37.23 12.57,34.95 12.57,33.41 15.44,30.54 U6.A12
A_TMDS1_P
  Top 0.2: U6.B12 17,30.54 16.5,30.04 15.43,30.04 12.21,33.26 12.21,34.79 10.12,36.88 9.8,36.88 9.47,36.55 J3.4
A_TMDS2_N
  Top 0.2: J3.3 9.51,36.05 9.82,35.73 10.48,35.73 11.66,34.55 11.66,33.11 15.24,29.54 U6.A11
A_TMDS2_P
  Top 0.2: U6.C11 17.7,29.04 15.23,29.04 11.31,32.96 11.31,34.39 10.32,35.38 9.8,35.38 9.47,35.05 J3.1
A_TMDS_CLK_N
  Top 0.2: J3.12 9.51,40.55 9.82,40.23 10.58,40.23 14.34,36.48 14.34,34.14 15.94,32.53 U6.A14
A_TMDS_CLK_P
  Top 0.2: J3.10 9.47,39.55 9.8,39.88 10.42,39.88 13.96,36.34 13.96,34 15.93,32.03 16.4,32.03 16.9,32.53 U6.B14
AD_CS  (via drill 0.15)
  Top 0.152: 17.6,11.33 17.59,11.35 U3.1 19.16,11.37 19.5,11.04 v19.5,9.44 | U6.F6 v20.7,25.04
  Route3 0.152: v20.7,25.04 20.3,25.04 20,24.74 20,18.74 20.8,17.94 20.8,11.73 19.5,10.44 v19.5,9.44
AD_DIN  (via drill 0.15)
  Top 0.152: 23.5,10.04 23.46,10.04 | 23.46,10.04 U3.14 | 23.46,10.04 22.4,10.04 v21.8,9.44 | U6.H4 v23.2,22.94
  Route3 0.152: v23.2,22.94 23.2,21.84 22,20.64 22,9.63 v21.8,9.44
AD_DOUT  (via drill 0.15)
  Top 0.152: 23.5,10.73 23.43,10.73 | 23.43,10.73 U3.15 | U6.H5 v23.7,24.04 | 23.43,10.73 22.2,10.73 21,9.54 v21,9.44
  Route3 0.152: v23.7,24.04 23.5,23.84 22.6,23.84 22,23.24 22,21.34 21.6,20.94 21.6,11.04 21,10.44 v21,9.44
AD_SCLK  (via drill 0.15)
  Top 0.152: U3.16 23.42,11.36 23.4,11.33 21.9,11.33 20.3,9.73 v20.3,9.44 | U6.G6 v21.7,25.04
  Route3 0.152: v21.7,25.04 21,24.34 21,21.74 21.2,21.54 21.2,11.44 20.3,10.54 v20.3,9.44
AIN0
  Top 0.254: U3.4 16.99,9.42 13.3,5.73 13.3,4.48 J6.P$2
AIN1
  Top 0.152: J4.P$2 13.34,1.94
  Top 0.254: 13.34,1.94 14.6,3.2 14.6,6.33 17.04,8.77 U3.5
AIN2
  Top 0.254: U3.6 17.09,8.12 15.88,6.91 J6.P$3
AIN3
  Top 0.152: J4.P$3 15.9,1.91
  Top 0.254: 15.9,1.91 17.1,3.1 17.1,5.83 16.5,6.43 16.5,6.83 17.14,7.47 U3.7
AIN4
  Top 0.254: J6.P$4 18.41,6.52 18.11,6.82 U3.8
AIN5
  Top 0.254: U3.9 20.19,6.82 19.7,6.33 19.7,3.19 J4.P$4
AIN6
  Top 0.254: U3.10 24.26,7.47 24.6,7.13 24.6,6.54 24.3,6.23 21.64,6.23 20.95,5.55 J6.P$5
AIN7
  Top 0.254: U3.11 24.61,8.12 25.2,7.54 25.2,6.23 24.8,5.83 24.8,3.8 24.2,3.2 22.25,3.2 J4.P$5
AUDIO1  (via drill 0.15)
  Top 0.152: R19.1 | U6.B8 17.1,26.54 v16.7,26.14
  Top 0.254: R19.1 v12.2,45.34
  Bottom 0.152: v12.2,45.34 12.2,45.03 10.1,42.93 10.1,31.64 15.1,26.64 15.1,26.54 16.3,26.54 v16.7,26.14
AUDIO2  (via drill 0.15)
  Top 0.152: U6.A8 v15.7,26.04
  Top 0.254: v12.7,45.93 13.3,45.34 15.5,45.34 16.33,44.5 16.33,42.79 R20.1
  Bottom 0.152: v15.7,26.04 15.1,26.04 9.7,31.44 9.7,43.03 11.6,44.93 11.6,45.53 12,45.93 v12.7,45.93
BS0
  Top 0.152: U6.R14 30.7,32.13 30.9,32.13 31,32.03 32.9,32.03 34,33.13 36.11,33.13 arc-90 36.3,32.94 36.3,32.54 arc90 36.49,32.35 36.49,32.35 arc90 36.68,32.54 36.68,32.94 arc-90 36.87,33.13 36.87,33.13 arc-90 37.06,32.94 37.06,32.54 arc90 37.25,32.35 37.26,32.35 arc90 37.45,32.54 37.45,32.94 arc-90 37.64,33.13 37.64,33.13 arc-90 37.83,32.94 37.83,32.54 arc90 38.02,32.35 38.02,32.35 arc90 38.21,32.54 38.21,32.94 arc-90 38.4,33.13 38.4,33.13 arc-90 38.59,32.94 38.59,32.54 arc90 38.78,32.35 38.79,32.35 arc90 38.98,32.54 38.98,32.94 arc-90 39.17,33.13 39.17,33.13 arc-90 39.36,32.94 39.36,32.54 arc90 39.55,32.35 39.55,32.35 arc90 39.74,32.54 39.74,32.94 arc-90 39.93,33.13 39.94,33.13 arc-90 40.13,32.94 40.13,32.54 arc90 40.32,32.35 40.32,32.35 arc90 40.51,32.54 40.51,32.94 arc-90 40.7,33.13 40.8,33.13 arc-90 41,32.93 41,32.73 arc90 41.4,32.34 51.4,32.34 51.7,32.03 51.7,31.34 U9.20
BS1
  Top 0.152: U9.21 52.48,32.16 51.9,32.73 46.5,32.73 arc-90 46.3,32.93 46.3,33.34 arc90 46.1,33.53 46,33.53 arc90 45.81,33.34 45.81,32.93 arc-90 45.62,32.73 45.6,32.73 arc-90 45.41,32.93 45.41,33.34 arc90 45.22,33.53 45.21,33.53 arc90 45.02,33.34 45.02,32.93 arc-90 44.83,32.73 44.81,32.73 arc-90 44.62,32.93 44.62,33.34 arc90 44.43,33.53 44.41,33.53 arc90 44.22,33.34 44.22,32.93 arc-90 44.03,32.73 44.02,32.73 arc-90 43.83,32.93 43.83,33.34 arc90 43.63,33.53 43.62,33.53 arc90 43.43,33.34 43.43,32.93 arc-90 43.24,32.73 43.22,32.73 arc-90 43.03,32.93 43.03,33.34 arc90 42.84,33.53 42.83,33.53 arc90 42.63,33.34 42.63,32.93 arc-90 42.44,32.73 42.43,32.73 arc-90 42.24,32.93 42.24,33.34 arc90 42.05,33.53 42.03,33.53 arc90 41.84,33.34 41.84,32.93 arc-90 41.65,32.73 41.63,32.73 arc-90 41.44,32.93 41.44,33.34 arc90 41.25,33.53 33.8,33.53 32.8,32.53 U6.T14
CAS#
  Top 0.152: U6.T4 32.1,22.54 32.2,22.44 37.3,22.44 37.8,21.94 37.89,21.84 37.89,21.76 arc90 38.08,21.57 38.11,21.57 arc90 38.3,21.76 38.3,21.84 arc-90 38.49,22.04 38.52,22.04 arc-90 38.71,21.84 38.71,21.76 arc90 38.9,21.57 38.92,21.57 arc90 39.11,21.76 39.11,21.84 arc-90 39.3,22.04 39.33,22.04 arc-90 39.52,21.84 39.52,21.76 arc90 39.71,21.57 39.74,21.57 arc90 39.93,21.76 39.93,21.84 arc-90 40.12,22.04 40.14,22.04 arc-90 40.34,21.84 40.34,21.76 arc90 40.52,21.57 40.55,21.57 arc90 40.74,21.76 40.74,21.84 arc-90 40.93,22.04 40.96,22.04 arc-90 41.15,21.84 41.15,21.76 arc90 41.34,21.57 41.37,21.57 arc90 41.55,21.76 41.55,21.84 arc-90 41.75,22.04 41.77,22.04 arc-90 41.96,21.84 41.96,21.76 arc90 42.15,21.57 42.18,21.57 arc90 42.37,21.76 42.37,21.84 arc-90 42.56,22.04 42.59,22.04 arc-90 42.77,21.84 42.77,21.76 arc90 42.97,21.57 42.99,21.57 arc90 43.18,21.76 43.18,21.84 arc-90 43.37,22.04 43.4,22.04 arc-90 43.59,21.84 43.59,21.76 arc90 43.78,21.57 43.8,21.57 arc90 44,21.76 44,21.84 arc-90 44.19,22.04 44.21,22.04 arc-90 44.4,21.84 44.4,21.76 arc90 44.59,21.57 44.62,21.57 arc90 44.81,21.76 44.81,21.84 arc-90 45,22.04 45.8,22.04 48.5,24.74 48.5,29.64 49.27,30.41 U9.17
CKE
  Top 0.152: U9.37 50.08,41.81 47.4,39.13 34.1,39.13 32.5,40.73 28.8,40.73 28.06,39.99 25.3,39.99 23,37.7 23,36.2 23.2,35.99 U6.H16
D0
  Top 0.152: 37.3,31.29 arc-90 37.3,31.24 | U6.T13 31.51,31.54 arc-90 31.66,31.38 31.66,31.1 arc90 31.81,30.95 31.94,30.95 arc90 32.09,31.1 32.09,31.48 arc-90 32.24,31.64 32.36,31.64 arc-90 32.52,31.48 32.52,30.5 arc90 32.67,30.35 32.79,30.35 arc90 32.94,30.5 32.94,31.38 arc-90 33.09,31.64 arc-90 33.35,31.48 33.35,29.69 arc90 33.5,29.54 33.64,29.54 arc90 33.79,29.69 33.79,32.18 arc-90 33.94,32.34 34.05,32.34 arc-90 34.2,32.18 34.2,29.69 arc90 34.35,29.54 34.46,29.54 arc90 34.61,29.69 34.61,32.58 arc-90 34.77,32.73 34.87,32.73 arc-90 35.02,32.58 35.02,29.69 arc90 35.18,29.54 35.28,29.54 arc90 35.44,29.69 35.44,32.58 arc-90 35.59,32.73 35.7,32.73 arc-90 35.85,32.58 35.85,29.69 arc90 36,29.54 36.09,29.54 arc90 36.25,29.69 36.25,29.68 arc-90 36.4,29.84 36.49,29.84 arc-90 36.65,29.68 36.65,29.69 arc90 36.8,29.54 36.9,29.54 arc90 37.1,29.74 37.1,30.24 37.3,30.44 37.3,31.29 | 37.3,31.29 U9.2
D1
  Top 0.152: U6.T12 31.7,30.54 31.7,30.53 32.1,30.13 | 38.9,31.29 U9.4 38.88,30.11 38.3,29.54 38.3,28.59 arc-90 38.1,28.39 arc-90 37.9,28.59 37.9,29.94 arc90 37.7,30.14 arc90 37.51,29.94 37.51,28.58 arc-90 37.32,28.39 37.28,28.39 arc-90 37.09,28.58 37.09,28.94 arc90 36.9,29.14 36.87,29.14 arc90 36.68,28.94 36.68,28.58 arc-90 36.49,28.39 36.45,28.39 arc-90 36.26,28.58 36.26,28.94 arc90 36.07,29.14 36.03,29.14 arc90 35.84,28.94 35.84,28.58 arc-90 35.65,28.39 35.62,28.39 arc-90 35.43,28.58 35.43,28.94 arc90 35.24,29.14 35.2,29.14 arc90 35.01,28.94 35.01,27.88 arc-90 34.82,27.69 34.79,27.69 arc-90 34.59,27.88 34.59,28.94 arc90 34.41,29.14 34.37,29.14 arc90 34.18,28.94 34.18,27.88 arc-90 33.99,27.69 33.95,27.69 arc-90 33.76,27.88 33.76,28.94 arc90 33.57,29.14 33.54,29.14 arc90 33.35,28.94 33.35,27.88 arc-90 33.16,27.69 33.12,27.69 arc-90 32.93,27.88 32.93,29.75 arc90 32.74,29.94 32.7,29.94 arc90 32.51,29.75 32.51,28.33 arc-90 32.32,28.14 32.29,28.14 arc-90 32.1,28.33 32.1,30.13 | 32.1,30.13 32.1,30.14
D2
  Top 0.152: U6.R12 30.7,30.04 31.5,30.04 31.7,29.84 31.7,28.04 32.5,27.24 37.2,27.24 37.4,27.44 40.85,27.44 arc90 41.05,27.64 arc90 40.85,27.84 38.9,27.84 arc-90 38.7,28.04 arc-90 38.89,28.23 40.86,28.23 arc90 41.05,28.42 41.05,28.43 arc90 40.86,28.62 38.89,28.62 arc-90 38.7,28.81 38.7,28.83 arc-90 38.89,29.02 40.86,29.02 arc90 41.05,29.21 41.05,29.23 arc90 40.86,29.42 39.19,29.42 arc-90 39,29.61 39,29.63 arc-90 39.19,29.82 40.06,29.82 arc90 40.25,30.01 40.25,30.03 arc90 40.06,30.21 39.89,30.21 arc-90 39.7,30.41 39.7,31.29 U9.5
D3
  Top 0.152: U6.T9 31.6,27.54 32.3,26.84 37.4,26.84 37.6,27.04 37.62,27.04 arc-90 37.81,26.84 37.81,25.47 arc90 38,25.28 38.02,25.28 arc90 38.21,25.47 38.21,26.84 arc-90 38.4,27.04 38.42,27.04 arc-90 38.61,26.84 38.61,25.47 arc90 38.8,25.28 38.82,25.28 arc90 39.01,25.47 39.01,26.84 arc-90 39.2,27.04 39.22,27.04 arc-90 39.41,26.84 39.41,25.47 arc90 39.6,25.28 39.62,25.28 arc90 39.81,25.47 39.81,26.84 arc-90 40,27.04 40.02,27.04 arc-90 40.21,26.84 40.21,25.47 arc90 40.4,25.28 40.42,25.28 arc90 40.61,25.47 40.61,26.84 arc-90 40.8,27.04 40.82,27.04 arc-90 41.01,26.84 41.01,25.47 arc90 41.2,25.28 41.22,25.28 arc90 41.45,25.51 41.45,30.49 41.3,30.64 41.3,31.29 U9.7
D4
  Top 0.152: U6.R9 30.7,27.04 31.5,27.04 32.1,26.44 37.1,26.44 37.4,26.14 37.4,25.24 37.8,24.84 42.64,24.84 arc183 42.65,25.21 42.07,25.21 arc-90 41.88,25.4 arc-90 42.11,25.64 42.64,25.64 arc183 42.65,26.01 42.07,26.01 arc-90 41.88,26.2 41.88,26.24 arc-90 42.07,26.43 42.65,26.43 arc90 42.84,26.62 42.84,26.62 arc90 42.65,26.81 42.07,26.81 arc-90 41.88,27 41.88,27 arc-90 42.07,27.19 42.65,27.19 arc90 42.84,27.38 42.84,27.38 arc90 42.65,27.58 42.07,27.58 arc-90 41.88,27.77 41.88,27.77 arc-90 42.07,27.96 42.65,27.96 arc90 42.84,28.15 42.84,28.15 arc90 42.65,28.34 42.07,28.34 arc-90 41.88,28.53 41.88,28.53 arc-90 42.07,28.72 42.65,28.72 arc90 42.84,28.91 42.84,28.92 arc90 42.65,29.11 42.07,29.11 arc-90 41.88,29.3 41.88,29.3 arc-90 42.07,29.49 42.65,29.49 arc90 42.84,29.68 42.84,29.68 arc90 42.65,29.87 42.07,29.87 arc-90 41.88,30.06 41.88,30.21 42.08,30.41 U9.8
D5
  Top 0.152: U6.T7 32.3,25.54 33.4,24.44 43.75,24.44 arc90 44.08,24.75 | 43.24,28.95 arc-90 43.43,29.15 43.93,29.15 arc90 44.12,29.34 44.12,29.34 arc90 43.93,29.53 43.43,29.53 arc-90 43.24,29.72 43.24,29.72 arc-90 43.43,29.91 43.93,29.91 arc90 44.12,30.1 44.12,30.1 arc90 43.93,30.29 43.91,30.29 arc-90 43.7,30.48 43.7,31.29 U9.10 | 43.24,28.95 | 43.24,28.95 arc90 43.43,28.76 43.93,28.76 arc-90 44.12,28.57 44.12,28.57 arc-90 43.93,28.38 43.43,28.38 arc90 43.24,28.19 43.24,28.19 arc90 43.43,28 43.93,28 arc-90 44.12,27.81 44.12,27.81 arc-90 43.93,27.62 43.43,27.62 arc90 43.24,27.43 43.24,27.43 arc90 43.43,27.24 43.93,27.24 arc-90 44.12,27.05 44.12,27.04 arc-90 43.93,26.85 43.43,26.85 arc90 43.24,26.66 43.24,26.66 arc90 43.43,26.47 43.93,26.47 arc-90 44.12,26.28 44.12,26.28 arc-90 43.93,26.09 43.43,26.09 arc90 43.24,25.9 43.24,25.9 arc90 43.43,25.71 43.93,25.71 arc-90 44.12,25.52 44.12,25.52 arc-90 43.92,25.32 43.39,25.32 arc90 43.2,25.13 43.2,25.13 arc90 43.39,24.94 43.89,24.94 arc-90 44.08,24.75 | 44.08,24.75
D6
  Top 0.152: U6.R7 30.7,25.04 32.2,25.04 33.2,24.04 45.08,24.04 arc90 45.26,24.22 | U9.11 44.5,31.29 44.5,29.99 arc90 44.69,29.8 45.07,29.8 arc-90 45.26,29.61 45.26,29.6 arc-90 45.07,29.41 44.69,29.41 arc90 44.5,29.22 44.5,29.21 arc90 44.69,29.03 45.07,29.03 arc-90 45.26,28.83 45.26,28.83 arc-90 45.07,28.64 44.69,28.64 arc90 44.5,28.45 44.5,28.44 arc90 44.69,28.25 45.07,28.25 arc-90 45.26,28.06 45.26,28.06 arc-90 45.07,27.87 44.69,27.87 arc90 44.5,27.68 44.5,27.67 arc90 44.69,27.48 45.07,27.48 arc-90 45.26,27.29 45.26,27.29 arc-90 45.07,27.1 44.69,27.1 arc90 44.5,26.91 44.5,26.9 arc90 44.69,26.71 45.07,26.71 arc-90 45.26,26.52 45.26,26.52 arc-90 45.07,26.33 44.69,26.33 arc90 44.5,26.14 | 44.5,26.15 44.5,26.14 | 44.5,26.14 arc90 44.69,25.95 45.07,25.95 arc-90 45.26,25.76 45.26,25.76 arc-90 45.07,25.57 44.69,25.57 arc90 44.5,25.38 44.5,25.37 arc90 44.69,25.18 45.07,25.18 arc-90 45.26,24.99 45.26,24.99 arc-90 45.07,24.8 44.69,24.8 arc90 44.5,24.61 44.5,24.6 arc90 44.69,24.41 45.07,24.41 arc-90 45.26,24.22 | 45.26,24.22
D7
  Top 0.152: U6.T6 32,24.54 32.9,23.64 45.3,23.64 arc90 45.6,23.84 arc-90 45.8,24.04 45.9,24.04 arc90 46.1,24.24 arc90 45.93,24.4 45.85,24.4 arc-90 45.66,24.59 45.66,24.63 arc-90 45.85,24.82 46.3,24.82 arc90 46.49,25.01 46.49,25.04 arc90 46.3,25.23 45.85,25.23 arc-90 45.66,25.42 45.66,25.46 arc-90 45.85,25.65 46.3,25.65 arc90 46.49,25.84 46.49,25.87 arc90 46.3,26.06 45.85,26.06 arc-90 45.66,26.25 45.66,26.29 arc-90 45.85,26.48 46.3,26.48 arc90 46.49,26.67 46.49,26.71 arc90 46.3,26.9 45.85,26.9 arc-90 45.66,27.09 45.66,27.12 arc-90 45.85,27.31 46.3,27.31 arc90 46.49,27.5 46.49,27.54 arc90 46.3,27.73 45.85,27.73 arc-90 45.66,27.92 45.66,27.95 arc-90 45.85,28.14 46.3,28.14 arc90 46.49,28.33 46.49,28.37 arc90 46.3,28.56 45.85,28.56 arc-90 45.66,28.75 45.66,28.78 arc-90 45.85,28.98 46.3,28.98 arc90 46.49,29.17 46.49,29.2 arc90 46.3,29.39 45.85,29.39 arc-90 45.66,29.58 45.66,29.62 arc-90 45.85,29.81 45.88,29.81 46,29.92 46,30.64 46.08,30.71 U9.13
D8
  Top 0.152: U9.42 46.08,41.71 44.7,40.34 34.5,40.34 32.9,41.93 28.14,41.93 27.4,41.2 24.6,41.2 21.8,38.39 21.8,35.63 21.2,35.03 U6.F16
D9
  Top 0.152: U6.E15 20.7,34.03 20.7,35.2 21.4,35.89 21.4,38.59 24.4,41.59 27.24,41.59 27.98,42.34 33,42.34 34.6,40.73 43.7,40.73 44.5,41.53 44.5,42.64 U9.44
D10
  Top 0.152: U9.45 43.67,41.71 43.1,41.13 34.8,41.13 33.2,42.73 27.78,42.73 27.04,41.99 24.2,41.99 21,38.79 21,36.39 20.24,35.63 20.2,35.63 U6.E16
D11
  Top 0.152: U9.47 42.08,42.06 42.1,42.03 41.6,41.53 35,41.53 33.4,43.13 27.64,43.13 26.9,42.39 22.2,42.39 21.9,42.09 arc-90 21.63,42.09 21.4,42.33 arc90 21.13,42.33 20.78,41.98 arc90 20.78,41.71 21.01,41.48 arc-90 21.01,41.21 20,40.2 19.5,40.2 19.1,39.79 19.1,35.89 19.2,35.79 U6.D16
D12
  Top 0.152: U9.48 41.3,42.7 41.3,44.03 40.2,45.13 35.3,45.13 34.9,44.73 26.9,44.73 26.16,43.99 19.76,43.99 17.2,41.43 U6.B16
D13
  Top 0.152: U9.50 39.67,43.86 38.8,44.73 35.6,44.73 35.2,44.34 27.1,44.34 26.36,43.59 20.16,43.59 17.7,41.13 17.7,34.03 U6.B15
D14
  Top 0.152: U9.51 38.9,42.7 38.9,43.84 38.4,44.34 35.9,44.34 35.35,43.78 35.35,43.59 arc-90 35.2,43.43 35.1,43.43 arc-90 34.95,43.59 34.95,43.78 arc90 34.79,43.93 34.69,43.93 arc90 34.54,43.78 34.54,43.59 arc-90 34.39,43.43 34.29,43.43 arc-90 34.14,43.59 34.14,43.78 arc90 33.99,43.93 27.3,43.93 26.56,43.2 20.56,43.2 18.2,40.84 U6.C16
D15
  Top 0.152: U9.53 37.27,43.56 36.9,43.93 36.3,43.93 35,42.63 34.5,42.63 33.6,43.53 27.5,43.53 26.76,42.79 20.96,42.79 20.18,42.02 arc90 20.18,41.75 20.45,41.48 arc-90 20.45,41.21 20.43,41.2 arc-90 20.16,41.2 19.9,41.46 arc90 19.63,41.46 19.62,41.45 arc90 19.62,41.18 19.89,40.92 arc-90 19.89,40.65 19.87,40.64 arc-90 19.6,40.64 19.34,40.9 arc90 19.07,40.9 18.7,40.53 18.7,33.93 18.3,33.53 U6.C15
DDC_SCL  (via drill 0.15)
  Top 0.152: U11.6 16.2,14.6 v16.8,14.6 17.2,15 RN5.6
  Top 0.203: J2.15 7.12,14.68 v7,14.8
  Route3 0.152: v7,14.8 7,14.83 9.5,14.83 9.8,15.13 15.9,15.13 16.43,14.6 v16.8,14.6
DDC_SDA  (via drill 0.15)
  Top 0.152: U11.5 16.17,15.57 v16.2,15.6 16.4,15.8 RN5.5
  Top 0.203: J2.16 9.95,15.18 10.1,15.33 v10.1,15.7
  Route3 0.152: v10.1,15.7 16.1,15.7 v16.2,15.6
DETECT1
  Top 0.152: 8.47,44.03 J3.19
  Top 0.254: 8.47,44.03 10.85,44.03 R17.2
DETECT2
  Top 0.203: R14.2 8.7,21.6 9.1,21.2 9.1,18.94 8.45,18.29 J2.19
EECLK  (via drill 0.2, 0.28)
  Top 0.203: 50.82,11.56 50.83,11.56
  Top 0.254: U1.4 50.02,11 | 50.02,11 R13.1 | 50.02,11 50.25,11 50.82,11.56 | U2.62 59.65,19.61 v59.05,20.2 | 50.83,11.56 51.4,12.13 52.1,12.13 52.8,12.83 v52.8,14.33
  Bottom 0.203: v59.05,20.2 58.55,20.2 57.91,19.57 57.91,16.85 56.6,15.54 55.3,15.54 54.6,14.83 53.3,14.83 v52.8,14.33
EECS  (via drill 0.2)
  Top 0.254: R10.1 48.19,9.53 U1.5 50.69,9.53 51.32,10.17 51.32,10.96 51.7,11.33 52.4,11.33 53.4,12.33 v53.4,13.94 | U2.63 60.15,17.23 59.82,16.9 v58.81,16.9
  Bottom 0.203: v58.81,16.9 58.66,16.9 56.8,15.04 55.5,15.04 54.8,14.33 53.8,14.33 v53.4,13.94
EEDATA  (via drill 0.2)
  Top 0.203: 52.75,10.48 54.47,12.21 R11.2 54.5,12.24 v55.2,12.73 | U2.61 59.15,19.09 v58.9,19.34
  Top 0.279: U1.3 52.75,10.48
  Bottom 0.203: v55.2,12.73 57,14.54 57.4,14.54 59.6,16.74 59.6,18.64 v58.9,19.34
FLASH-CS#  (via drill 0.2)
  Top 0.152: U6.T3 31.9,21.54 v32.5,20.94
  Top 0.254: v44.1,18.64 43.6,18.14 43.6,14.73 43.9,14.44 U10.1
  Bottom 0.152: v32.5,20.94 32.9,20.54 43.3,20.54 44.1,19.74 v44.1,18.64
FPGA-CCLK  (via drill 0.15, 0.2)
  Top 0.203: U6.R11 29.9,29.54 v29.8,29.64
  Top 0.254: U10.6 42.94,16.98 v43,16.94
  Bottom 0.152: v43,16.94 42.9,17.04 41.7,17.04 40,18.74 37.2,18.74 36.4,17.94 28.2,17.94 26.8,19.34 26.8,26.94 28.2,28.34 28.8,28.34 29.2,28.74 29.2,29.24 29.6,29.64 v29.8,29.64
FPGA-CLK-1
  Top 0.152: U6.K3 25.7,21.04 25.7,16.54 25.5,16.34 25.5,13.54 25.75,13.29 U8.3
FPGA-CLK-2
  Top 0.152: U6.J4 24.3,22.54 24.7,22.14 24.7,19.24 25.1,18.84 25.1,10.23 25.75,9.58 U7.3
FPGA-MISO  (via drill 0.15, 0.2)
  Top 0.152: U6.P10 v28.7,29.04
  Top 0.254: U10.2 44.83,15.71 v44.4,16.14
  Bottom 0.152: v44.4,16.14 44.2,16.34 41.8,16.34 39.8,18.34 37.4,18.34 36.6,17.54 28,17.54 26.4,19.14 26.4,27.14 28,28.74 28.4,28.74 v28.7,29.04
FPGA-MOSI  (via drill 0.15)
  Top 0.152: 31.1,28.54 U6.T10 31.2,28.14 31,27.94 v30.7,27.94
  Top 0.2: U10.5 41.9,18.25 42,18.24 v42.4,18.64
  Bottom 0.152: v42.4,18.64 42.3,18.64 41,19.94 35.8,19.94 34.2,18.34 28.4,18.34 27.2,19.54 27.2,26.74 28.4,27.94 v30.7,27.94
FPGA_SCL  (via drill 0.15)
  Top 0.152: U11.3 v18.4,14.63 17.9,14.63 17.7,14.83 17.7,15.63 18,15.94 RN5.7 | U6.C1 18.2,19.34 17.4,18.54 v17.4,18.24
  Route3 0.152: v17.4,18.24 17.4,17.14 18.9,15.63 18.9,14.83 18.7,14.63 v18.4,14.63
FPGA_SDA  (via drill 0.15)
  Top 0.152: U11.4 19.07,15.13 18.8,15.4 | 18.8,15.4 RN5.8 | U6.B1 16.7,19.04 v16.7,18.24 | 18.8,15.4 18.36,15.4 v18.3,15.33
  Route3 0.152: v16.7,18.24 16.7,17.24 18.3,15.63 v18.3,15.33
FTDI_D0  (via drill 0.15, 0.2)
  Top 0.152: U2.38 50.33,25.01 v49.9,25.44 | U6.M7 v27.7,25.04
  Bottom 0.152: v49.9,25.44 49.6,25.44 49,24.84 29.27,24.84 28.96,24.54 28.2,24.54 v27.7,25.04
FTDI_D1  (via drill 0.15, 0.2)
  Top 0.152: U2.39 49.93,24.51 v49.9,24.54 | U6.N6 v28.7,24.04
  Bottom 0.152: v49.9,24.54 49.6,24.54 49.5,24.44 29.5,24.44 29.1,24.04 v28.7,24.04
FTDI_D2  (via drill 0.15, 0.2)
  Top 0.152: v49.6,23.84 50.1,23.84 50.3,24.04 51.17,24.04 U2.40 | U6.M6 v27.7,24.04
  Bottom 0.152: v49.6,23.84 49.4,24.04 29.7,24.04 29.2,23.54 28.2,23.54 v27.7,24.04
FTDI_D3  (via drill 0.15, 0.2)
  Top 0.152: v49,23.24 50.1,23.24 50.4,23.54 51.17,23.54 U2.41 | U6.P5 v29.7,23.04
  Bottom 0.152: v49,23.24 48.6,23.64 30.3,23.64 v29.7,23.04
FTDI_D4  (via drill 0.15, 0.2)
  Top 0.152: U2.43 48.53,22.51 v48.4,22.64 | U6.N5 v28.7,23.04
  Bottom 0.152: v48.4,22.64 47.8,23.24 30.7,23.24 30,22.54 29.2,22.54 v28.7,23.04
FTDI_D5  (via drill 0.15, 0.2)
  Top 0.152: U6.P4 v29.7,22.04 | U2.44 47.83,22.01 v47.8,22.04
  Bottom 0.152: v29.7,22.04 30.2,22.04 31,22.84 47,22.84 v47.8,22.04
FTDI_D6  (via drill 0.15, 0.2)
  Top 0.152: U6.P2 v29.7,21.04 | v47.2,21.44 47.4,21.24 48.9,21.24 49.17,21.51 U2.45
  Bottom 0.152: v47.2,21.44 46.2,22.44 31.2,22.44 29.8,21.04 v29.7,21.04
FTDI_D7  (via drill 0.15, 0.2)
  Top 0.152: U6.P1 v29.7,20.04 | v46.6,20.84 46.7,20.74 49.2,20.74 49.47,21.01 U2.46
  Bottom 0.152: v46.6,20.84 45.4,22.04 31.5,22.04 29.7,20.24 v29.7,20.04
FTDI_RD  (via drill 0.2)
  Top 0.152: U6.M1 28.4,18.34 29.7,18.34 30,18.04 35.7,18.04 v36.2,18.54 | U2.53 55.15,16.89 v55.3,16.74
  Bottom 0.152: v55.3,16.74 54.9,16.34 50.5,16.34 49.3,17.54 41.8,17.54 40.2,19.14 36.8,19.14 v36.2,18.54
FTDI_RXF  (via drill 0.15, 0.2)
  Top 0.152: v46,20.24 46.23,20.01 U2.48 | U6.N3 v28.7,21.04
  Bottom 0.152: v28.7,21.04 29.2,20.54 29.2,19.74 29.4,19.54 30.1,19.54 30.3,19.74 30.3,20.24 31.7,21.64 44.6,21.64 v46,20.24
FTDI_SIWUA  (via drill 0.15, 0.2)
  Top 0.152: U2.55 56.15,19.49 55.3,20.34 52.8,20.34 52,19.54 50.2,19.54 50.1,19.64 43.5,19.64 43.1,20.04 38.2,20.04 37.7,19.54 33.4,19.54 v33.2,19.34 | U6.M3 v27.7,21.04
  Bottom 0.152: v27.7,21.04 28.2,20.54 28.2,19.74 28.8,19.14 33,19.14 v33.2,19.34
FTDI_TXE  (via drill 0.2)
  Top 0.152: U6.N1 28.2,19.34 28.7,18.84 30.2,18.84 30.6,18.44 35.2,18.44 v35.3,18.54 | U2.52 54.65,17.18 v54.5,17.04
  Bottom 0.152: v54.5,17.04 54.3,16.84 50.6,16.84 49.5,17.94 42,17.94 40.4,19.54 36.3,19.54 v35.3,18.54
FTDI_WR  (via drill 0.15, 0.2)
  Top 0.152: U2.54 55.65,19.29 54.99,19.95 53.1,19.95 52.19,19.04 50.1,19.04 49.9,19.24 43.2,19.24 42.8,19.64 38.5,19.64 38,19.14 34.1,19.14 v33.9,18.94 | U6.M2 v27.7,20.04
  Bottom 0.152: v27.7,20.04 27.7,19.54 28.5,18.74 33.7,18.74 v33.9,18.94
GND  (via drill 0.15, 0.15 pad 0.03, 0.2, 0.25, 0.28)
  Top 0.152: 65.8,28.14 65.9,28.24 v66.4,28.24 v65.8,28.24 | v67,28.24 v67.6,28.24 v68.2,28.24 v68.8,28.24 | v69.4,28.24 v68.8,28.24 | v68.8,28.24 v67,28.24 | v67,28.24 v65.8,28.24 | v65.8,28.24 v65.8,27.64 v66.4,27.64 | U6.T16 v32,34.53 | U6.L15 v26.7,34.03 | U6.H9 v22.7,27.04 U6.G8 v21.7,27.04 v20.7,27.04 U6.E9 | U6.K9 v24.7,27.04 U6.J8 | U6.T1 31.8,19.54 v32,19.74 | C16.2 36.98,21.22 v37,21.14 | 36.47,42.67 U9.54 36.44,42.63 36.44,42.38 36.3,42.23 v35.8,42.23 | U9.52 38.08,43.66 v38,43.73 | U6.B11 v17.3,29.94 | U6.P3 v28.7,22.04 26.9,22.04 26.7,21.84 26.7,21.04 U6.L2 | v5.7,37.1 5.7,37.22 5.8,37.12 | 5.7,40.17 v5.7,40.2 | v5.7,41.5 5.7,41.57 5.72,41.55 | 6.18,43.05 6.2,43.07 8.43,43.07 J3.17 | U9.12 45.27,30.36 v45.3,30.34 | U9.6 40.48,30.56 v40.8,30.24 | 9.5,33.57 R3.1 | 6.4,11.18 v6.4,11.2 | 6.52,14.18 v6.4,14.2 | 6.52,12.68 v6.4,12.7 | 6.4,9.68 v6.4,9.7 | C21.2 32.17,38.96 v32.5,38.63 | U2.35 50.03,26.51 50,26.54 | 50,26.54 50,28.14 | v49.9,26.24 50,26.34 50,26.54 | U2.51 54.15,18.78 v54.6,19.24 | C12.2 49,18.07 48.47,18.07 | 48.2,18.34 v48.2,18.44 | 46.35,18.34 U10.4 | U6.N11 v27.9,29.24 | U6.H7 v23.7,25.04 24.7,25.04 U6.K7 v25.7,26.04 25.7,26.84 25.9,27.04 26.7,27.04 U6.M8 | U6.G2 v22.7,20.04 | 64.14,7.17 U4.1 | C6.2 54.75,13.79 | U9.28 57.4,42.53 | RN2.4 RN2.3 RN2.2 RN2.1 66.72,28.51 v67,28.24 | 67.03,27.66 v67,27.64 | S2.1 S2.2 | 73.29,16.14 72.3,17.14 72.3,19.19 R1.1 | U6.R10 v30.5,28.94 | U6.B7 17.2,25.84 17.4,26.04 v17.5,26.04 | 19.1,22.44 U6.D4 U6.C4 18.5,22.54 v18.5,22.24 | U6.R6 29.7,25.04 v28.7,25.04 | v52.32,7.6 52.34,7.6 | C17.2 35.97,25.57 36.1,25.44 | 15,38.98 C14.2 | C27.2 20.07,39.1 v21,40.03 | 23.94,15.73 C20.2 | C20.2 24.1,14.01 C13.2
  Top 0.152: U6.A1 16,19.34 v16,18.24 | C20.2 23.74,15.94 | C20.2 24.1,15.63
  Top 0.178: U6.N13 v28.7,32.03 U6.P14 | U6.D13 v19.2,31.94 | U6.H12 v23.7,30.04
  Top 0.2: J5.G4 63.92,42.56 v63.65,42.84 | J5.G3 63.92,34.51 v64.3,34.13 | J5.T6 73.5,36.94 v73.3,36.73 v73.3,34.53 73.3,33.73 73.45,33.58 J5.G2 | J5.G1 73.83,44.9 v73.5,45.23 | U6.J5 24.7,24.04 24.7,25.04 | C26.2 26.63,38.46 v27.3,38.53
  Top 0.203: U6.G15 v22.7,34.03 | 9.5,33.57 10.3,32.93 11.29,31.94 | U9.41 46.88,43.51 v47,43.63 47,44.49 C36.2 | U9.46 42.88,43.51 v43.1,43.73 | 30.98,14.44 C28.2 | U9.28 57.27,44.49 | S1.2 38.96,8.29 39,8.34 | 44.58,8.34 S1.1 | 56.1,14.13 C8.2 | 60.9,14.44 C9.2 60.83,14.57 61,14.73 v61.7,14.73 62.3,14.73 C10.2 | U3.3 16.7,10.07 C11.2 | 63.5,7.63 63.67,7.63 U4.1 | 24.1,15.63 v23.5,16.23 22.4,16.23 22.2,16.44 22.2,16.96 C31.2 | X1.5 68.75,28.19 v68.8,28.24 | 14.6,39.03 14.7,39.13 C14.2
  Top 0.254: U1.2 51.7,9.53 51.32,9.15 51.32,8.21 51.7,7.83 52.09,7.83 v52.32,7.6 | R15.1 64.49,20.01 U2.1 64.58,20.01 64.64,20.07 v64.64,19.19 65.25,19.19 65.64,18.8 C5.2 | U2.15 61.67,27.01 61.21,26.55 | U2.10 U2.11 62.6,24.79 62.61,24.77 60.58,24.77 60.45,24.9 | U2.5 61.31,22.01 60.45,22.87 v60.45,23.12 60.45,24.9 | 60.45,24.9 60.45,25.79 | 60.45,25.79 61.21,26.55 | U2.13 61.76,26.01 61.21,26.55 | U2.25 56.65,27.89 58.75,25.79 60.45,25.79 | v5.7,38.6 5.7,37.22 | J3.2 7.16,35.57 5.9,35.57 5.7,35.77 v5.7,37.1 5.76,37.03 8.44,37.03 J3.5 | v5.7,38.6 5.7,40.17 5.83,40.03 8.44,40.03 J3.11 | v5.7,40.2 v5.7,41.5 | 5.7,41.57 5.7,42.57 6.18,43.05 J3.17 10.23,43.05 R17.1 10.9,40.73 12.3,39.34 12.99,39.34 C15.2 C14.2 | J3.14 5.72,41.55 | J2.17 6.88,15.68 6.4,15.2 v6.4,14.2 v6.4,12.7 v6.4,11.2 | J2.2 6.72,8.18 6.4,8.5 6.4,9.68 J2.5 | v6.4,9.7 6.4,11.18 J2.8 | J2.14 6.52,14.18 | J2.11 6.52,12.68 | 50,28.14 C2.2 | U2.47 52.17,20.51 52.42,20.76 v52.42,21.18 | C4.2 49.49,16.54 49,17.04 49,18.07 | C1.2 50.12,13.51 50.2,13.44 50.9,13.44 | v50.9,13.13 50.9,13.44 | 50.9,13.44 51.72,13.44 C3.2 | 48.47,18.07 48.2,18.34 | v48.2,18.44 48.1,18.34 46.35,18.34 | C7.2 66.06,27.98 v66.4,27.64 v67,27.64 | 72.18,19.25 R1.1 72.07,19.14 v71.1,19.14 v70.4,19.14 69.6,19.14 69.49,19.25 R21.1 | 64,7.41 U4.1 | C38.2 56.33,14.27 C8.2 | U3.12 24.86,8.77 25.7,7.93 25.7,6.73 v26.2,6.23 | 39,8.34 v40.4,8.34 v43.2,8.34 44.58,8.34 | 54.75,13.79 55.25,13.79 v55.4,13.94 55.6,14.13 56.1,14.13 | RN1.1 RN1.2 59.33,45.36 | 59.33,45.36 RN1.3 RN1.4 | 52.34,7.6 53.6,6.33 55.43,6.33 C24.2 | J6.P$1 10.85,4.45 11.9,5.5 11.9,6.5 R2.1 | U6.A16 16.1,34.53 16,34.63 15.5,34.63 15,35.13 15,38.98 15.58,38.98 C23.2
  Top 0.254: 14.6,39.03 14.6,38.53 v14.1,38.03 | J3.8 8.44,38.53 5.76,38.53 v5.7,38.6 | 59.33,45.36 59.33,47.35 U$7.P$20
  Top 0.279: C3.2 52.08,13.48
  Top 0.305: S2.2 S2.3 S2.4 73.29,16.14
  Top 0.406: R3.1 8.9,33.57 8.2,34.27 v8,34.27 v7.4,34.27
  Top 1: 31.3,7.54 31.6,7.54 31.8,7.73 31.8,7.93 | 31.8,7.93 31.8,8.34 | 31.8,7.93 32.5,7.93 | 61.58,6.23 61.58,7.65 63.5,7.63 | 63.5,7.63 v60.8,7.63 | 63.5,7.63 65.8,7.63 65.82,7.61 C18.2
  Top 1.016: v65.8,28.24 65.8,28.14 69.4,28.14
  other vias: 31.3,9.44 30.8,8.23 32.7,8.23 32.7,7.63 59.6,8.23 60.2,8.23 60.8,8.23 61.4,8.23 62,8.23 60.2,7.63 61.4,7.63 62,7.63 60.8,7.04 61.4,7.04 62,7.04 36.8,25.54
  pour Top: 30.8,9.83 30.8,7.43 30.9,7.33 32.9,7.33 32.9,8.94 31.9,9.94
  pour Top: 60.36,6.63 60.36,3.2 62.98,3.2 62.98,8.54 59.3,8.54 59.3,6.63
  pour Top: 69.8,27.44 65.4,27.44 65.4,28.64 69.8,28.64
  pour Top (rank 3): 0,0 76.2,0 76.2,52.07 0,52.07
  pour Route4 (rank 3): 0,0 76.2,0 76.2,52.07 0,52.07
  pour Route4: 0,0 76.2,0 76.2,52.07 0,52.07
LDQM
  Top 0.152: U6.T5 32.4,23.54 32.7,23.24 45.8,23.24 46.9,24.34 46.9,24.61 arc-90 47.09,24.8 47.29,24.8 arc90 47.48,24.99 47.48,25.05 arc90 47.29,25.24 47.09,25.24 arc-90 46.9,25.43 46.9,25.49 arc-90 47.09,25.68 47.49,25.68 arc90 47.68,25.87 47.68,25.93 arc90 47.49,26.12 47.09,26.12 arc-90 46.9,26.31 46.9,26.37 arc-90 47.09,26.56 47.49,26.56 arc90 47.68,26.75 47.68,26.81 arc90 47.49,27 47.09,27 arc-90 46.9,27.19 46.9,27.25 arc-90 47.09,27.44 47.49,27.44 arc90 47.68,27.63 47.68,27.69 arc90 47.49,27.88 47.09,27.88 arc-90 46.9,28.07 46.9,28.13 arc-90 47.09,28.32 47.49,28.32 arc90 47.68,28.51 47.68,28.57 arc90 47.49,28.76 47.09,28.76 arc-90 46.9,28.95 46.9,29.01 arc-90 47.09,29.2 47.49,29.2 arc90 47.68,29.4 47.68,29.45 arc90 47.49,29.64 47.29,29.64 arc-90 47.1,29.84 arc-90 47.3,30.04 arc90 47.7,30.54 47.7,31.29 U9.15
LED1  (via drill 0.15, 0.15 pad 0.03)
  Top 0.152: U6.P11 v28.7,30.04 | LED1.A 59.84,42.57 v59.65,42.38
  Bottom 0.152: v59.65,42.38 49.6,32.34 34.5,32.34 32.2,30.04 30.3,30.04 30.2,30.14 28.8,30.14 v28.7,30.04
LED2  (via drill 0.15)
  Top 0.152: U6.N9 28.2,27.74 28.5,28.04 29.4,28.04 29.7,28.34 v29.7,28.94 | LED2.A 59.36,41.2 v59,40.84
  Bottom 0.152: v59,40.84 50.1,31.94 34.9,31.94 31.4,28.44 30.2,28.44 v29.7,28.94
LED3  (via drill 0.15)
  Top 0.152: U6.P9 v29.7,27.04 | LED3.A 59.71,38.52 v59.3,38.93
  Bottom 0.152: v29.7,27.04 31.2,27.04 35.3,31.14 51.4,31.14 59.2,38.93 v59.3,38.93
LED4  (via drill 0.15)
  Top 0.152: U6.M9 27.7,27.04 v28.7,27.04 | LED4.A 59.11,39.84 v58.9,39.63
  Bottom 0.152: v28.7,27.04 29.2,27.54 30.2,27.54 30.3,27.44 31,27.44 35.1,31.54 50.8,31.54 v58.9,39.63
LED5  (via drill 0.15)
  Top 0.152: U6.N8 v27.8,26.54 | v59.1,36.63 59.6,36.63 60.27,35.97 LED5.A
  Bottom 0.152: v27.8,26.54 30,26.54 30.5,26.04 31.7,26.04 35.1,29.44 39.9,29.44 40.1,29.24 51.2,29.24 58.6,36.63 v59.1,36.63
LED6  (via drill 0.15)
  Top 0.152: U6.P7 v28.7,26.04 | LED6.A 60.62,32.85 v59.8,32.03
  Bottom 0.152: v28.7,26.04 29.5,25.24 32.2,25.24 35.6,28.64 39.5,28.64 39.7,28.44 52,28.44 55.7,32.13 59.7,32.13 v59.8,32.03
LED7  (via drill 0.15)
  Top 0.152: U6.P8 v29.7,26.04 | LED7.A 59.92,34.52 59.6,34.84 59.6,35.7 59.4,35.9 v59.4,35.93
  Bottom 0.152: v29.7,26.04 30.1,25.64 32,25.64 35.4,29.04 39.7,29.04 39.9,28.84 51.6,28.84 58.7,35.93 v59.4,35.93
LED8  (via drill 0.15)
  Top 0.152: U6.T8 v30.8,26.54 | v58.7,37.34 60.23,37.34 LED8.A